# EAGLE design CANTensegrityBoard (EAGLE 6.5.0)

## Sheet 1 of 6
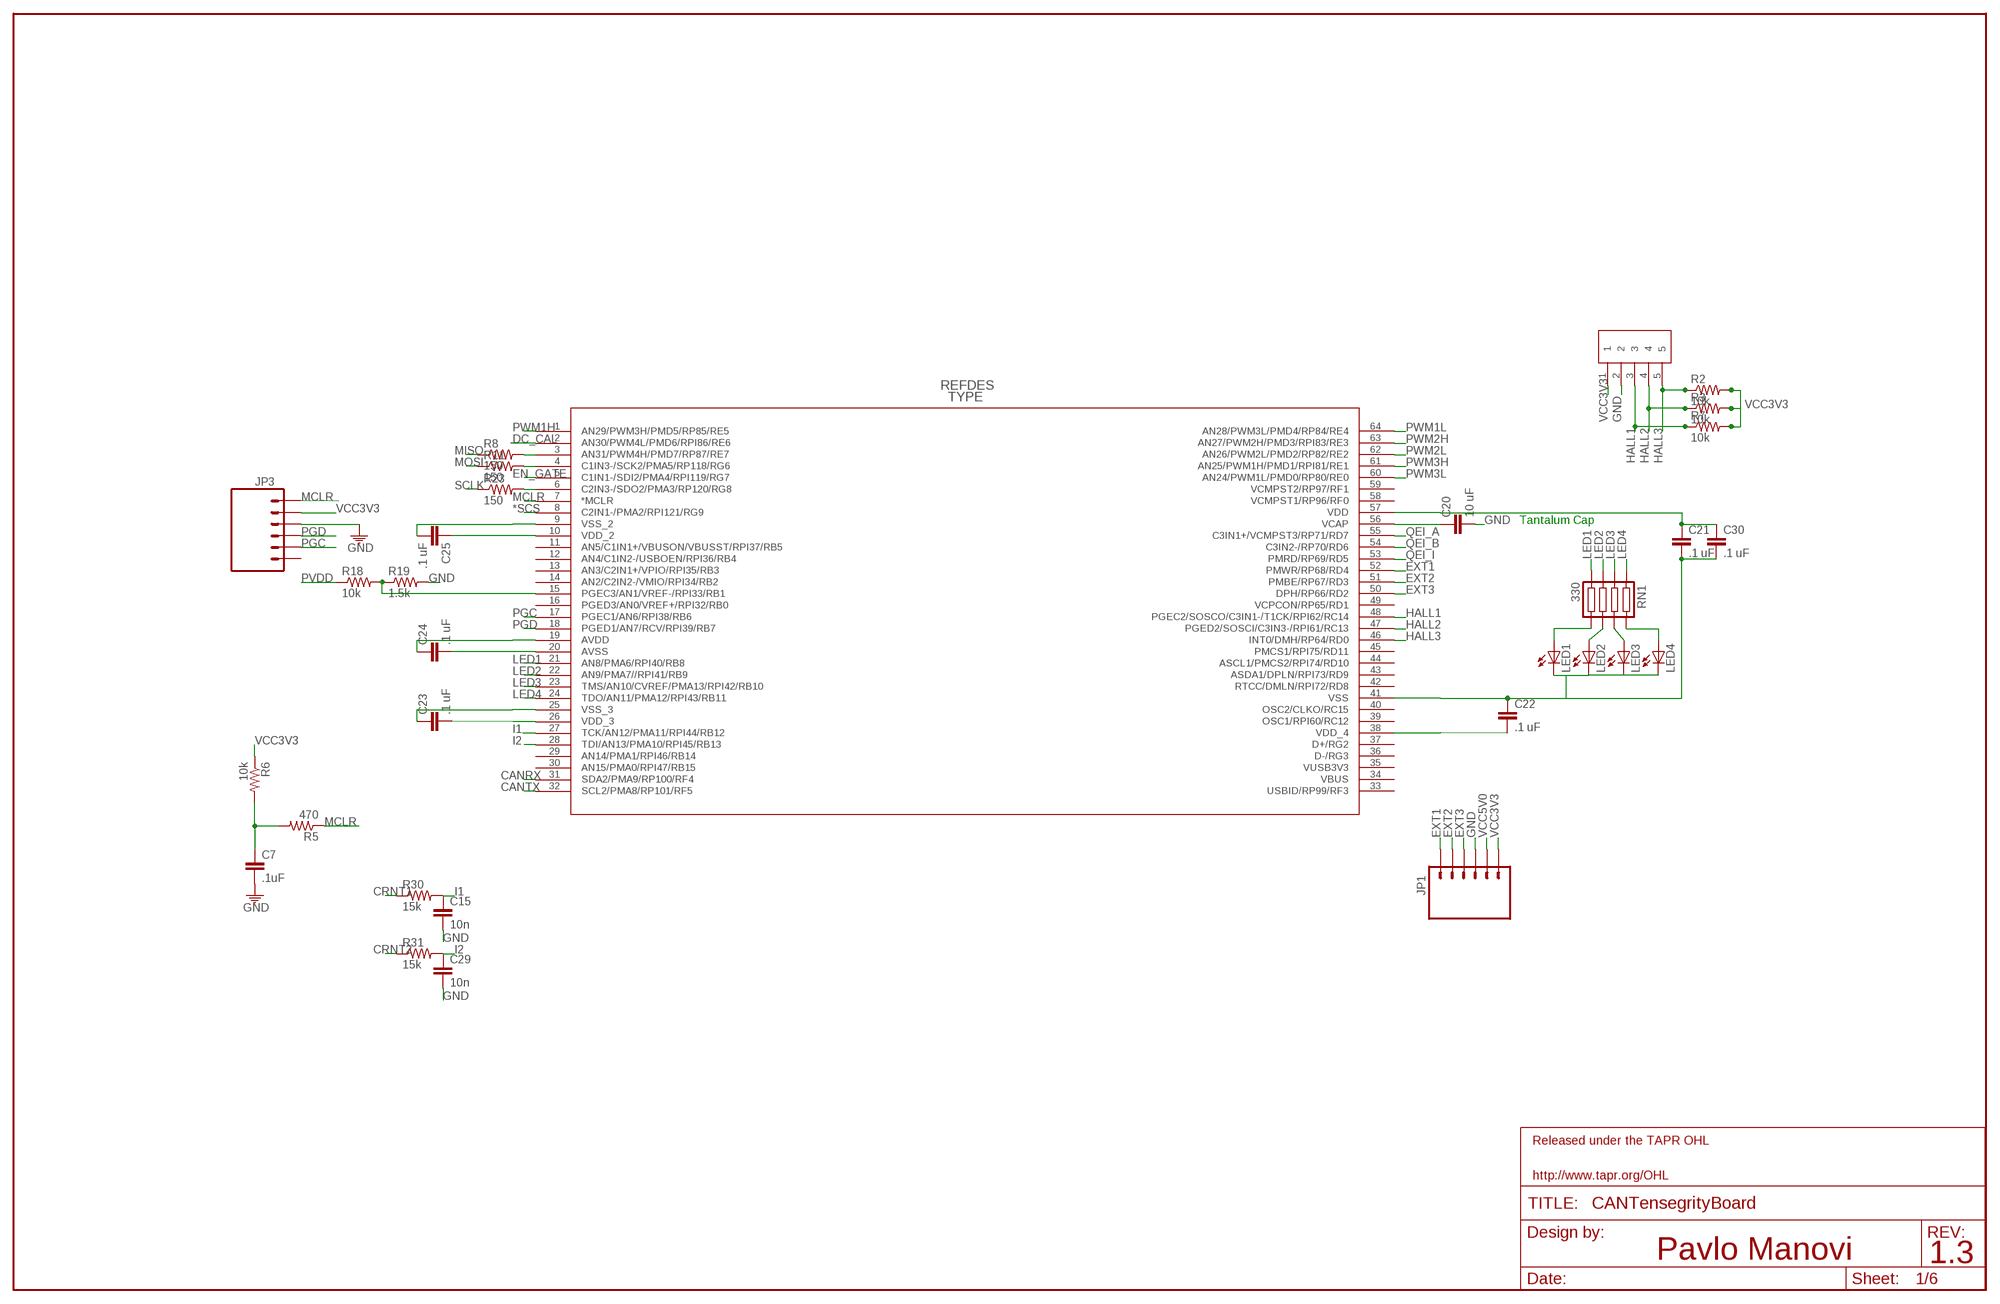
[diagram p0: schematic, sheet 1]

### Parts
C7  .1uF  CAP0805  [0805]
C15  10n  CAP0805  [0805]
C20  10 uF  CAP0805  [0805]
C21  .1 uF  CAP0805  [0805]
C22  .1 uF  CAP0805  [0805]
C23  .1 uF  CAP0805  [0805]
C24  .1 uF  CAP0805  [0805]
C25  .1 uF  CAP0805  [0805]
C29  10n  CAP0805  [0805]
C30  .1 uF  CAP0805  [0805]
JP1  M06DUAL_ROW  [2X03]
JP3  M06LOCK  [1X06_LOCK]
LED1  LED0805  [LED-0805]
LED2  LED0805  [LED-0805]
LED3  LED0805  [LED-0805]
LED4  LED0805  [LED-0805]
R2  10k  RESISTOR0805-RES  [0805]
R3  10k  RESISTOR0805-RES  [0805]
R5  470  RESISTOR0805-RES  [0805]
R6  10k  RESISTOR0805-RES  [0805]
R7  10k  RESISTOR0805-RES  [0805]
R8  150  RESISTOR0805-RES  [0805]
R11  150  RESISTOR0805-RES  [0805]
R18  10k  RESISTOR0805-RES  [0805]
R19  1.5k  RESISTOR0805-RES  [0805]
R23  150  RESISTOR0805-RES  [0805]
R30  15k  RESISTOR0805-RES  [0805]
R31  15k  RESISTOR0805-RES  [0805]
RN1  330  RESISTOR_ARRAY-4  [EXB-38V271JV]
U6  DSPIC33EP256MU80  [QFP64-10X10MC]
U$20  MICROCLASP5  [55932-0510]

### Nets
*SCS [Power]: U6.8(C2IN1-/PMA2/RPI121/RG9) ; also sheet 2
CANRX: U6.31(SDA2/PMA9/RP100/RF4) ; also sheet 4
CANTX: U6.32(SCL2/PMA8/RP101/RF5) ; also sheet 4
CRNT1: R30.1 ; also sheet 2
CRNT2: R31.1 ; also sheet 2
DC_CAL: U6.2(AN30/PWM4L/PMD6/RPI86/RE6) ; also sheet 2
EN_GATE: U6.5(C1IN1-/SDI2/PMA4/RPI119/RG7) ; also sheet 2
EXT1: JP1.1 U6.52(PMWR/RP68/RD4)
EXT2: JP1.2 U6.51(PMBE/RP67/RD3)
EXT3: JP1.3 U6.50(DPH/RP66/RD2)
GND [Power]: C7.2 C15.2 C20.2 C21.2 C22.1 C23.1 C24.2 C25.2 C29.2 C30.2 JP1.4 JP3.3 LED1.2(C) LED2.2(C) LED3.2(C) LED4.2(C) R19.2 U6.9(VSS_2) U6.20(AVSS) U6.25(VSS_3) U6.41(VSS) U$20.2 ; also sheet 2,3,4,5,6
HALL1: R7.1 U6.48(PGEC2/SOSCO/C3IN1-/T1CK/RPI62/RC14) U$20.3
HALL2: R3.1 U6.47(PGED2/SOSCI/C3IN3-/RPI61/RC13) U$20.4
HALL3: R2.1 U6.46(INT0/DMH/RP64/RD0) U$20.5
I1: C15.1 R30.2 U6.27(TCK/AN12/PMA11/RPI44/RB12)
I2: C29.1 R31.2 U6.28(TDI/AN13/PMA10/RPI45/RB13)
LED1: RN1.P$4 U6.21(AN8/PMA6/RPI40/RB8)
LED2: RN1.P$3 U6.22(AN9/PMA7//RPI41/RB9)
LED3: RN1.P$2 U6.23(TMS/AN10/CVREF/PMA13/RPI42/RB10)
LED4: RN1.P$1 U6.24(TDO/AN11/PMA12/RPI43/RB11)
MCLR: JP3.1 R5.1 U6.7(*MCLR)
MISO: R8.1 ; also sheet 2
MOSI: R11.1 ; also sheet 2
N$2: C7.1 R5.2 R6.2
N$3: R8.2 U6.3(AN31/PWM4H/PMD7/RP87/RE7)
N$7: R11.2 U6.4(C1IN3-/SCK2/PMA5/RP118/RG6)
N$8: R23.2 U6.6(C2IN3-/SDO2/PMA3/RP120/RG8)
N$25: R18.2 R19.1 U6.15(PGEC3/AN1/VREF-/RPI33/RB1)
N$31: C20.1 U6.56(VCAP)
N$44: LED1.1(A) RN1.P$5
N$45: LED2.1(A) RN1.P$6
N$46: LED3.1(A) RN1.P$7
N$47: LED4.1(A) RN1.P$8
PGC: JP3.5 U6.17(PGEC1/AN6/RPI38/RB6)
PGD [small]: JP3.4 U6.18(PGED1/AN7/RCV/RPI39/RB7)
PVDD [Power]: R18.1 ; also sheet 2,3,5
PWM1H: U6.1(AN29/PWM3H/PMD5/RP85/RE5) ; also sheet 2
PWM1L: U6.64(AN28/PWM3L/PMD4/RP84/RE4) ; also sheet 2
PWM2H: U6.63(AN27/PWM2H/PMD3/RPI83/RE3) ; also sheet 2
PWM2L: U6.62(AN26/PWM2L/PMD2/RP82/RE2) ; also sheet 2
PWM3H: U6.61(AN25/PWM1H/PMD1/RPI81/RE1) ; also sheet 2
PWM3L: U6.60(AN24/PWM1L/PMD0/RP80/RE0) ; also sheet 2
QEI_A: U6.55(C3IN1+/VCMPST3/RP71/RD7) ; also sheet 6
QEI_B: U6.54(C3IN2-/RP70/RD6) ; also sheet 6
QEI_I: U6.53(PMRD/RP69/RD5) ; also sheet 6
SCLK: R23.1 ; also sheet 2
VCC3V3 [Power]: C21.1 C22.2 C23.2 C24.1 C25.1 C30.1 JP1.6 JP3.2 R2.2 R3.2 R6.1 R7.2 U6.10(VDD_2) U6.19(AVDD) U6.26(VDD_3) U6.38(VDD_4) U6.57(VDD) U$20.1 ; also sheet 2,4,5,6
VCC5V0: JP1.5 ; also sheet 5,6
Unconnected: JP3.6 U6.11(AN5/C1IN1+/VBUSON/VBUSST/RPI37/RB5) U6.12(AN4/C1IN2-/USBOEN/RPI36/RB4) U6.13(AN3/C2IN1+/VPIO/RPI35/RB3) U6.14(AN2/C2IN2-/VMIO/RPI34/RB2) U6.16(PGED3/AN0/VREF+/RPI32/RB0) U6.29(AN14/PMA1/RPI46/RB14) U6.30(AN15/PMA0/RPI47/RB15) U6.33(USBID/RP99/RF3) U6.34(VBUS) U6.35(VUSB3V3) U6.36(D-/RG3) U6.37(D+/RG2) U6.39(OSC1/RPI60/RC12) U6.40(OSC2/CLKO/RC15) U6.42(RTCC/DMLN/RPI72/RD8) U6.43(ASDA1/DPLN/RPI73/RD9) U6.44(ASCL1/PMCS2/RPI74/RD10) U6.45(PMCS1/RPI75/RD11) U6.49(VCPCON/RP65/RD1) U6.58(VCMPST1/RP96/RF0) U6.59(VCMPST2/RP97/RF1)

### Notes on the sheet
- Tantalum Cap

## Sheet 2 of 6
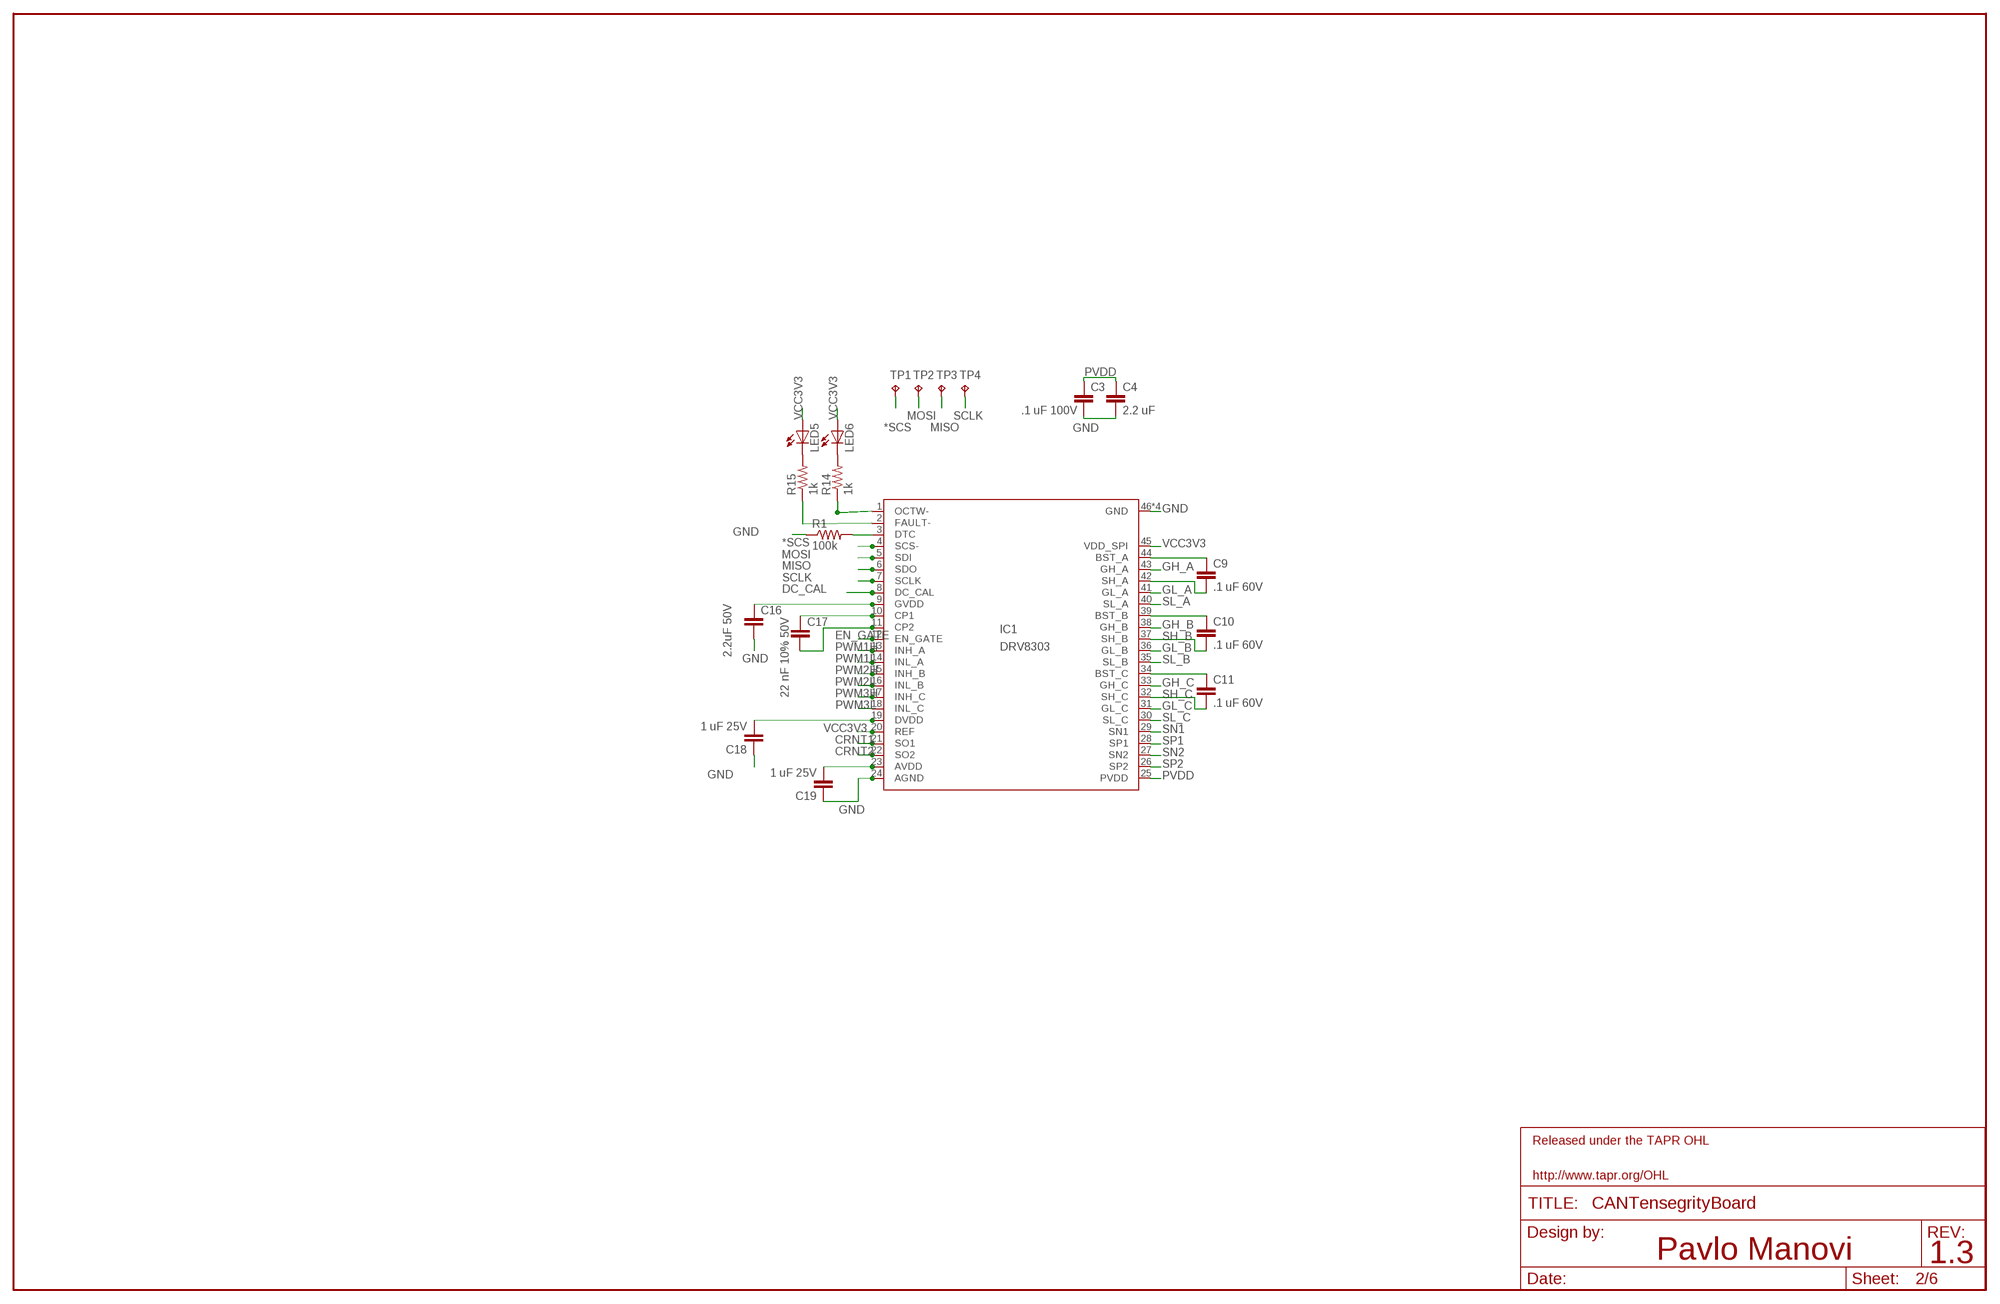
[diagram p1: schematic, sheet 2]

### Parts
C3  .1 uF 100V  CAP0805  [0805]
C4  2.2 uF  CAP0805  [0805]
C9  .1 uF 60V  CAP0805  [0805]
C10  .1 uF 60V  CAP0805  [0805]
C11  .1 uF 60V  CAP0805  [0805]
C16  2.2uF 50V  CAP0805  [0805]
C17  22 nF 10% 50V  CAP0805  [0805]
C18  1 uF 25V  CAP0805  [0805]
C19  1 uF 25V  CAP0805  [0805]
IC1  DRV8303  [HTSSOP-480-DCA]
LED5  LED0805  [LED-0805]
LED6  LED0805  [LED-0805]
R1  100k  RESISTOR0805-RES  [0805]
R14  1k  RESISTOR0805-RES  [0805]
R15  1k  RESISTOR0805-RES  [0805]
TP1  TPTP06R  [TP06R]
TP2  TPTP06R  [TP06R]
TP3  TPTP06R  [TP06R]
TP4  TPTP06R  [TP06R]

### Nets
*SCS [Power]: IC1.4(SCS-) TP1.TP ; also sheet 1
BST_B: C10.1 IC1.39(BST_B)
BST_C: C11.1 IC1.34(BST_C)
CRNT1: IC1.21(SO1) ; also sheet 1
CRNT2: IC1.22(SO2) ; also sheet 1
DC_CAL: IC1.8(DC_CAL) ; also sheet 1
EN_GATE: IC1.12(EN_GATE) ; also sheet 1
GH_A: IC1.43(GH_A) ; also sheet 3
GH_B: IC1.38(GH_B) ; also sheet 3
GH_C: IC1.33(GH_C) ; also sheet 3
GL_A: IC1.41(GL_A) ; also sheet 3
GL_B: IC1.36(GL_B) ; also sheet 3
GL_C: IC1.31(GL_C) ; also sheet 3
GND [Power]: C3.2 C4.2 C16.2 C18.1 C19.1 IC1.24(AGND) IC1.46(GND) IC1.47(GND) IC1.48(GND) IC1.49(GND) R1.1 ; also sheet 1,3,4,5,6
MISO: IC1.6(SDO) TP3.TP ; also sheet 1
MOSI: IC1.5(SDI) TP2.TP ; also sheet 1
N$1: IC1.3(DTC) R1.2
N$4: C9.1 IC1.44(BST_A)
N$11: LED5.2(C) R15.2
N$12: IC1.1(OCTW-) R14.1
N$17: LED6.2(C) R14.2
N$18: C16.1 IC1.9(GVDD)
N$19: C17.1 IC1.10(CP1)
N$20: C17.2 IC1.11(CP2)
N$21: C18.2 IC1.19(DVDD)
N$22: C19.2 IC1.23(AVDD)
N$24: IC1.2(FAULT-) R15.1
PVDD [Power]: C3.1 C4.1 IC1.25(PVDD) ; also sheet 1,3,5
PWM1H: IC1.13(INH_A) ; also sheet 1
PWM1L: IC1.14(INL_A) ; also sheet 1
PWM2H: IC1.15(INH_B) ; also sheet 1
PWM2L: IC1.16(INL_B) ; also sheet 1
PWM3H: IC1.17(INH_C) ; also sheet 1
PWM3L: IC1.18(INL_C) ; also sheet 1
SCLK: IC1.7(SCLK) TP4.TP ; also sheet 1
SH_A: C9.2 IC1.42(SH_A) ; also sheet 3
SH_B: C10.2 IC1.37(SH_B) ; also sheet 3
SH_C: C11.2 IC1.32(SH_C) ; also sheet 3
SL_A: IC1.40(SL_A) ; also sheet 3
SL_B [Power]: IC1.35(SL_B) ; also sheet 3
SL_C: IC1.30(SL_C) ; also sheet 3
SN1: IC1.29(SN1) ; also sheet 3
SN2: IC1.27(SN2) ; also sheet 3
SP1 [Power]: IC1.28(SP1) ; also sheet 3
SP2 [Power]: IC1.26(SP2) ; also sheet 3
VCC3V3 [Power]: IC1.20(REF) IC1.45(VDD_SPI) LED5.1(A) LED6.1(A) ; also sheet 1,4,5,6

## Sheet 3 of 6
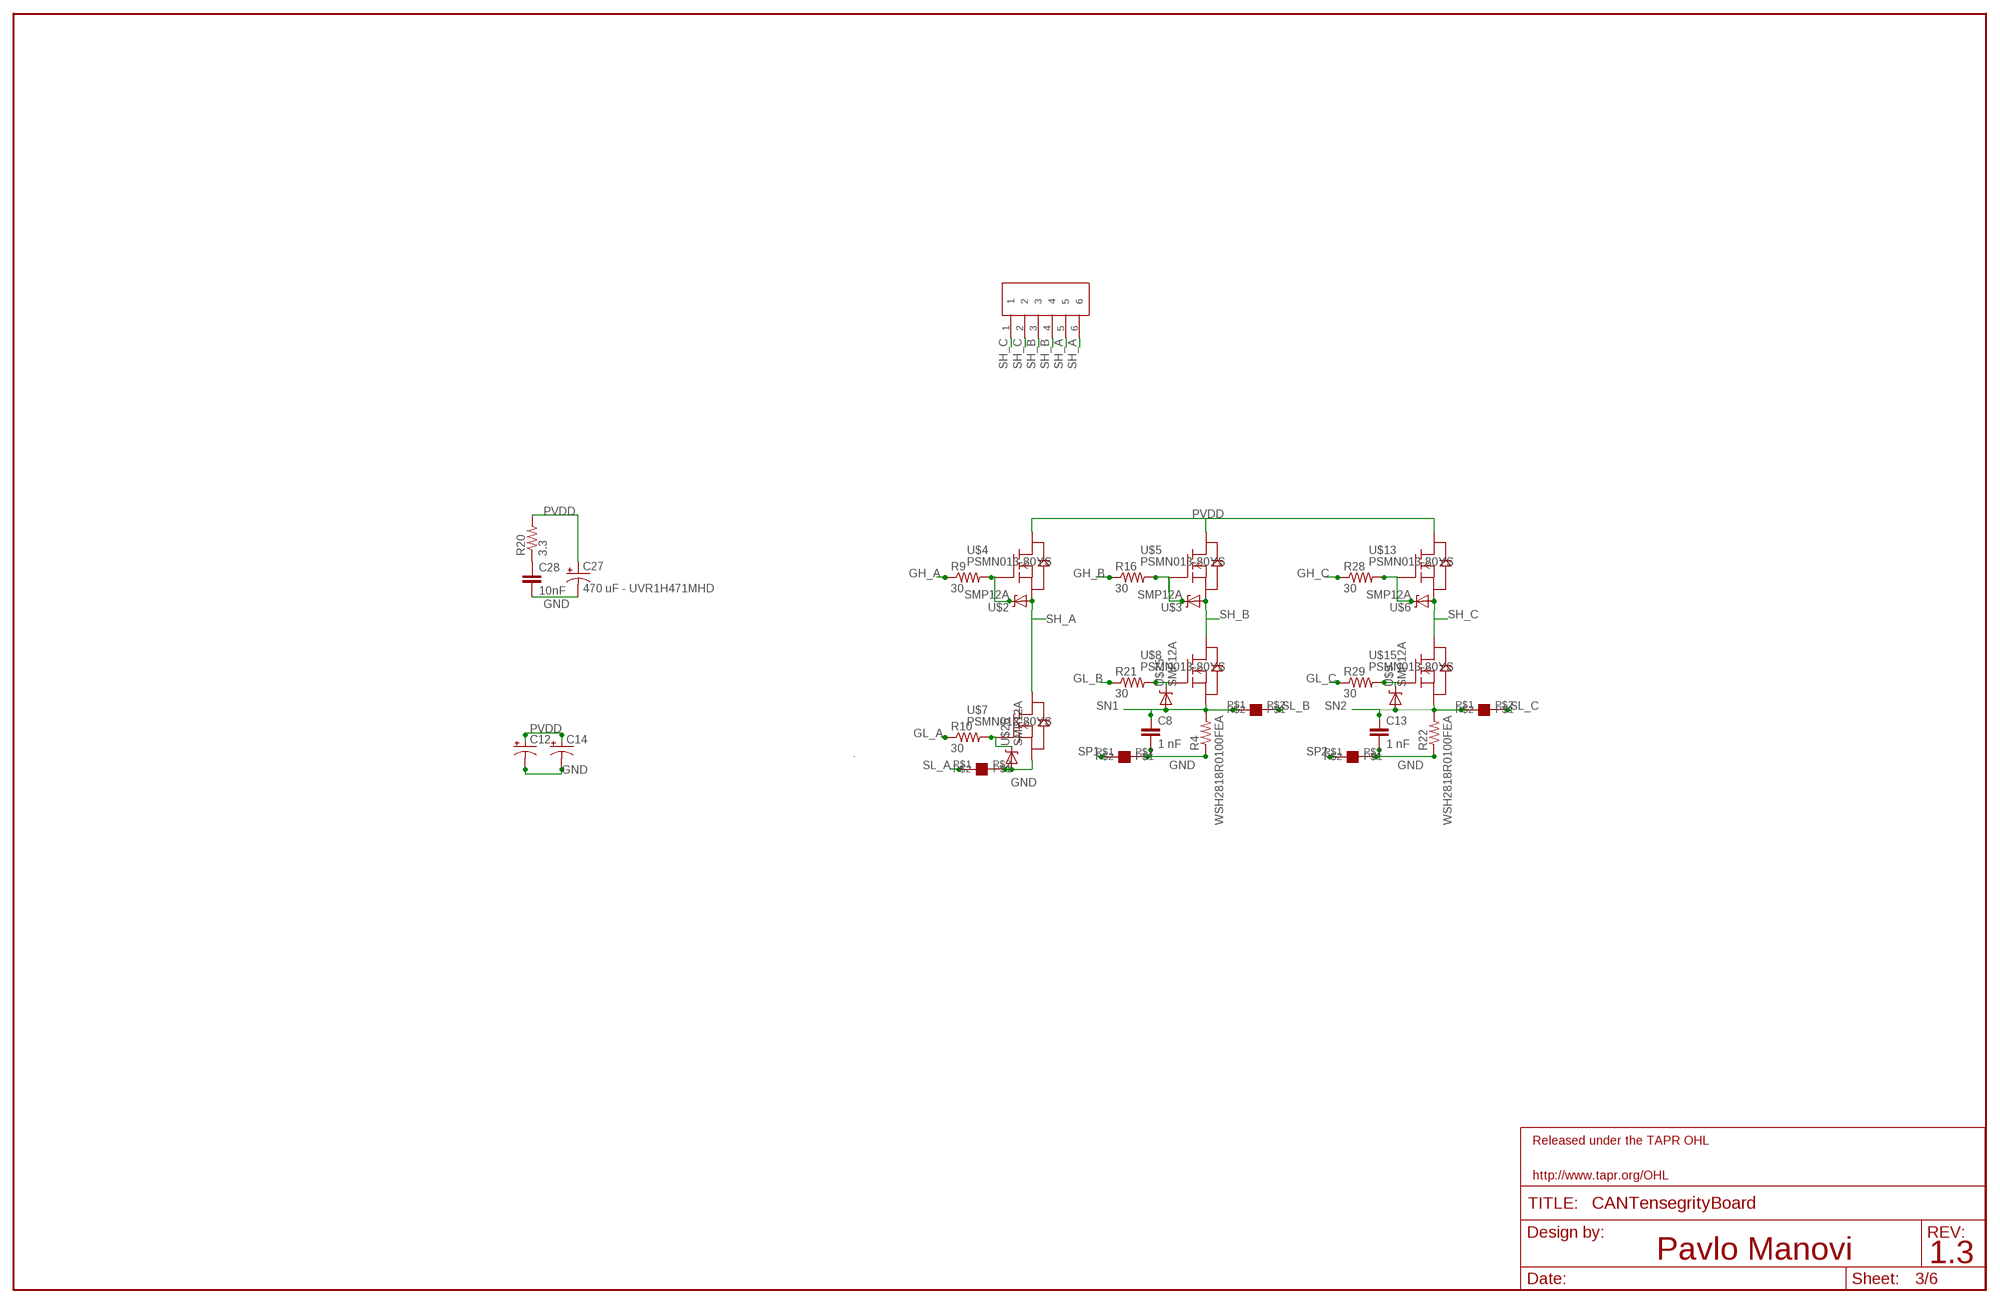
[diagram p2: schematic, sheet 3]

### Parts
C8  1 nF  CAP0805  [0805]
C12  CAP_POLPTH2  [CPOL-RADIAL-10UF-25V]
C13  1 nF  CAP0805  [0805]
C14  CAP_POLPTH2  [CPOL-RADIAL-10UF-25V]
C27  470 uF - UVR1H471MHD  CAP_POLPTH4  [CPOL-RADIAL-1000UF-25V]
C28  10nF  CAP0805  [0805]
R4  WSH2818R0100FEA  RESISTOR  [SMT-REF]
R9  30  RESISTOR0805-RES  [0805]
R10  30  RESISTOR0805-RES  [0805]
R16  30  RESISTOR0805-RES  [0805]
R20  3.3  RESISTOR0805-RES  [0805]
R21  30  RESISTOR0805-RES  [0805]
R22  WSH2818R0100FEA  RESISTOR  [SMT-REF]
R28  30  RESISTOR0805-RES  [0805]
R29  30  RESISTOR0805-RES  [0805]
U$2  SMP12A  [DO-220AA]
U$3  SMP12A  [DO-220AA]
U$4  PSMN013-80YS  [TO127P600X120-5N]
U$5  PSMN013-80YS  [TO127P600X120-5N]
U$6  SMP12A  [DO-220AA]
U$7  PSMN013-80YS  [TO127P600X120-5N]
U$8  PSMN013-80YS  [TO127P600X120-5N]
U$9  SMP12A  [DO-220AA]
U$10  NETJUMPER  [NETJUMPER]
U$11  NETJUMPER  [NETJUMPER]
U$12  NETJUMPER  [NETJUMPER]
U$13  PSMN013-80YS  [TO127P600X120-5N]
U$15  PSMN013-80YS  [TO127P600X120-5N]
U$17  MINIFITJR6PIN  [0039288060]
U$23  NETJUMPER  [NETJUMPER]
U$24  NETJUMPER  [NETJUMPER]
U$25  SMP12A  [DO-220AA]
U$26  SMP12A  [DO-220AA]

### Nets
GH_A: R9.1 ; also sheet 2
GH_B: R16.1 ; also sheet 2
GH_C: R28.1 ; also sheet 2
GL_A: R10.1 ; also sheet 2
GL_B: R21.1 ; also sheet 2
GL_C: R29.1 ; also sheet 2
GND [Power]: C8.2 C12.2(-) C13.2 C14.2(-) C27.2(-) C28.2 R4.1 R22.1 U$7.1(S) U$7.2(S) U$7.3(S) U$10.P$2 U$11.P$2 U$23.P$2 U$26.ANODE(A) ; also sheet 1,2,4,5,6
N$6: C28.1 R20.1
N$9: R9.2 U$2.CATHODE(C) U$4.4(G)
N$10: R10.2 U$7.4(G) U$26.CATHODE(C)
N$32: R16.2 U$3.CATHODE(C) U$5.4(G)
N$33: R21.2 U$8.4(G) U$25.CATHODE(C)
N$36: R28.2 U$6.CATHODE(C) U$13.4(G)
N$39: R29.2 U$9.CATHODE(C) U$15.4(G)
PVDD [Power]: C12.1(+) C14.1(+) C27.1(+) R20.2 U$4.5(D) U$4.P$1(D) U$4.P$2(D) U$4.P$3(D) U$4.P$4(D) U$4.P$5(D) U$4.P$6(D) U$4.P$7(D) U$4.P$8(D) U$4.P$9(D) U$5.5(D) U$5.P$1(D) U$5.P$2(D) U$5.P$3(D) U$5.P$4(D) U$5.P$5(D) U$5.P$6(D) U$5.P$7(D) U$5.P$8(D) U$5.P$9(D) U$13.5(D) U$13.P$1(D) U$13.P$2(D) U$13.P$3(D) U$13.P$4(D) U$13.P$5(D) U$13.P$6(D) U$13.P$7(D) U$13.P$8(D) U$13.P$9(D) ; also sheet 1,2,5
SH_A: U$2.ANODE(A) U$4.1(S) U$4.2(S) U$4.3(S) U$7.5(D) U$7.P$1(D) U$7.P$2(D) U$7.P$3(D) U$7.P$4(D) U$7.P$5(D) U$7.P$6(D) U$7.P$7(D) U$7.P$8(D) U$7.P$9(D) U$17.5 U$17.6 ; also sheet 2
SH_B: U$3.ANODE(A) U$5.1(S) U$5.2(S) U$5.3(S) U$8.5(D) U$8.P$1(D) U$8.P$2(D) U$8.P$3(D) U$8.P$4(D) U$8.P$5(D) U$8.P$6(D) U$8.P$7(D) U$8.P$8(D) U$8.P$9(D) U$17.3 U$17.4 ; also sheet 2
SH_C: U$6.ANODE(A) U$13.1(S) U$13.2(S) U$13.3(S) U$15.5(D) U$15.P$1(D) U$15.P$2(D) U$15.P$3(D) U$15.P$4(D) U$15.P$5(D) U$15.P$6(D) U$15.P$7(D) U$15.P$8(D) U$15.P$9(D) U$17.1 U$17.2 ; also sheet 2
SL_A: U$10.P$1 ; also sheet 2
SL_B [Power]: U$12.P$2 ; also sheet 2
SL_C: U$24.P$2 ; also sheet 2
SN1: C8.1 R4.2 U$8.1(S) U$8.2(S) U$8.3(S) U$12.P$1 U$25.ANODE(A) ; also sheet 2
SN2: C13.1 R22.2 U$9.ANODE(A) U$15.1(S) U$15.2(S) U$15.3(S) U$24.P$1 ; also sheet 2
SP1 [Power]: U$11.P$1 ; also sheet 2
SP2 [Power]: U$23.P$1 ; also sheet 2

## Sheet 4 of 6
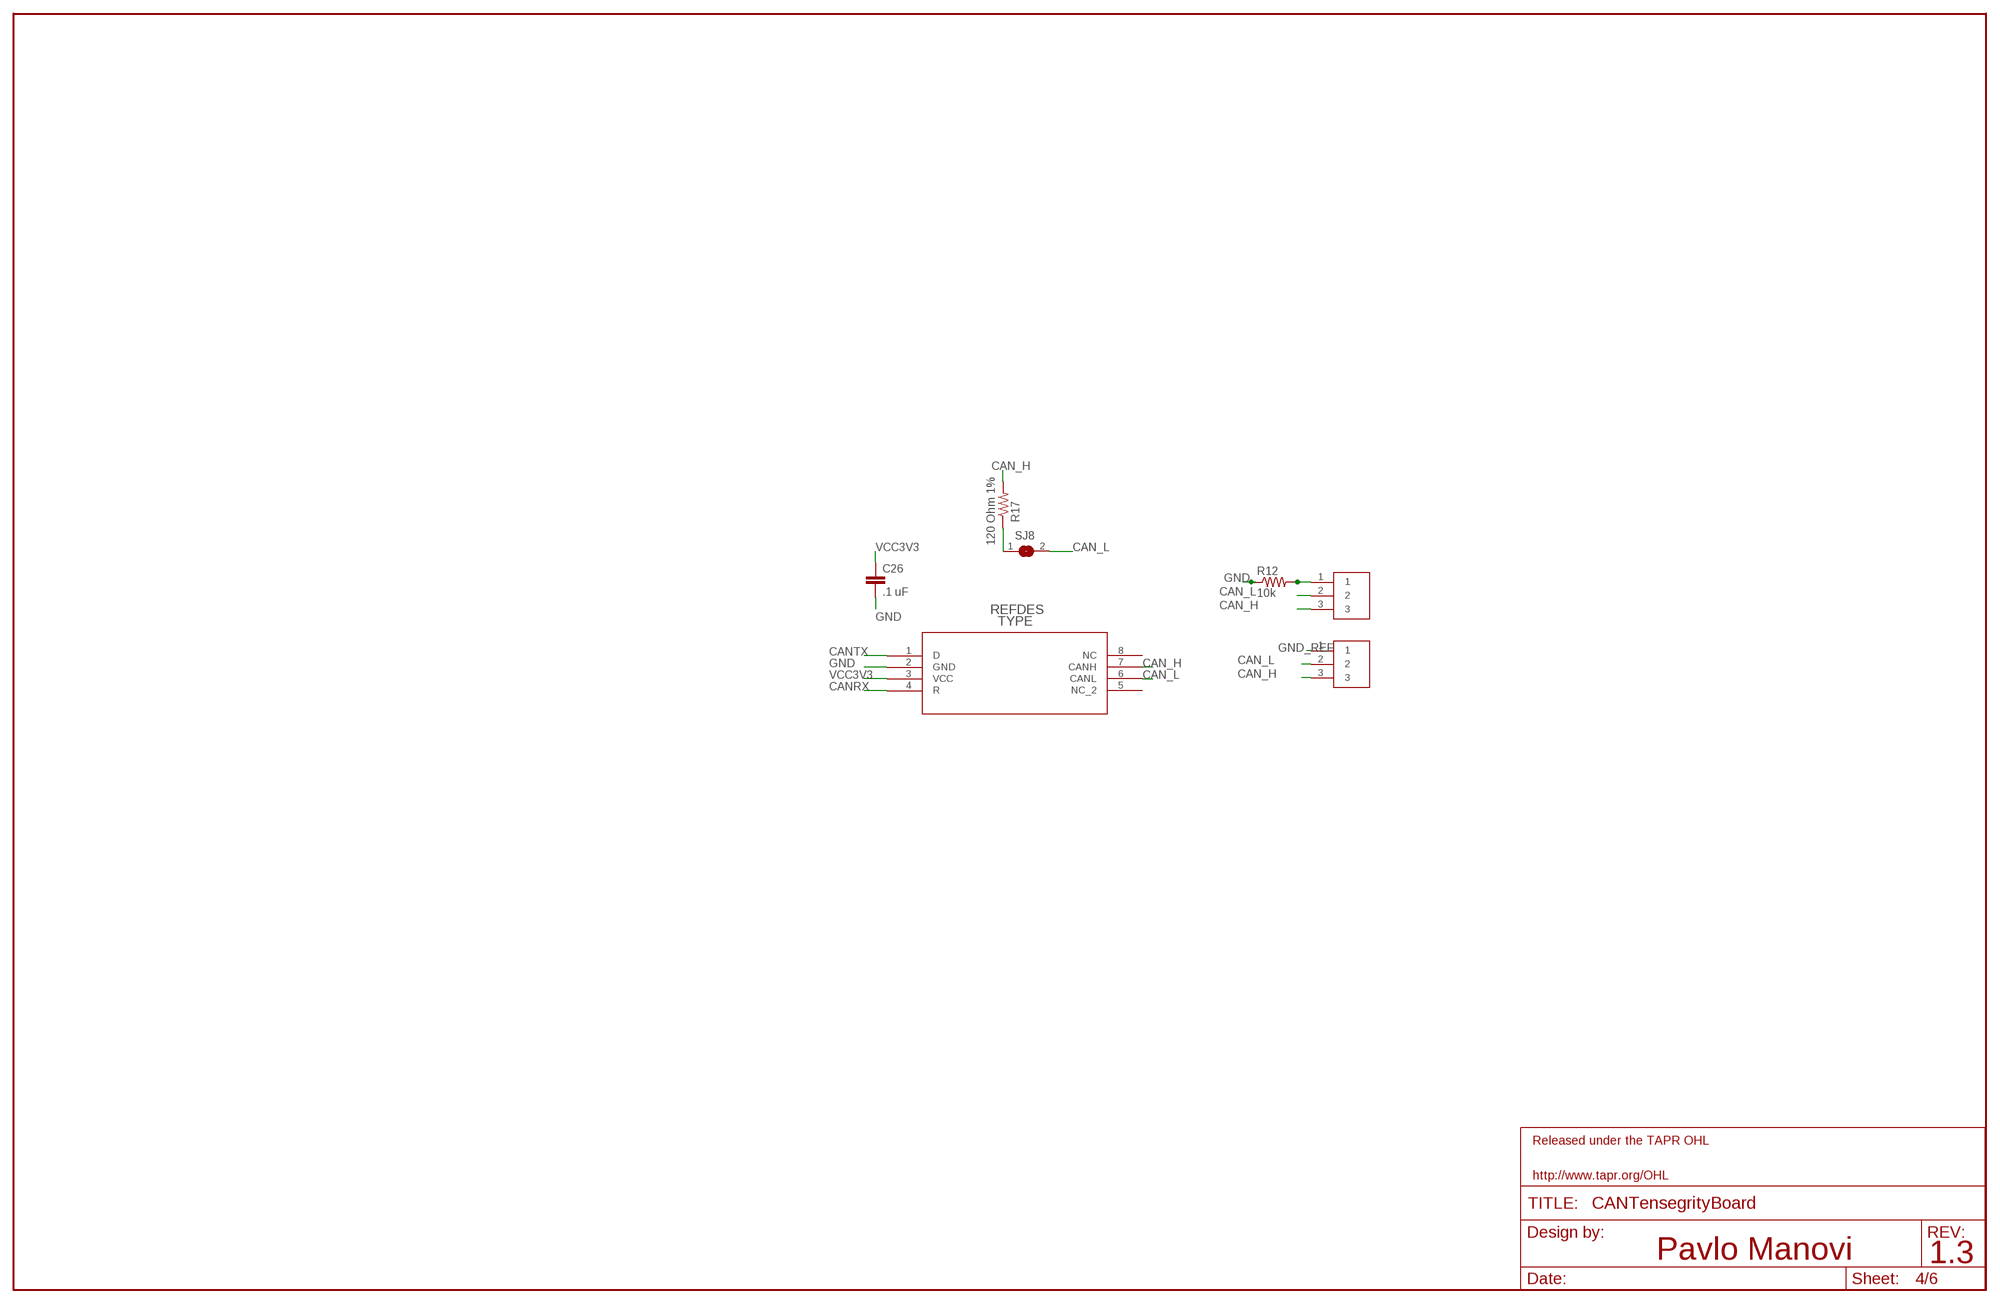
[diagram p3: schematic, sheet 4]

### Parts
C26  .1 uF  CAP0805  [0805]
R12  10k  RESISTOR0805-RES  [0805]
R17  120 Ohm 1%  RESISTOR0805-RES  [0805]
SJ8  SJ  [SJ]
U2  SN65HVD232_D_8  [D8]
U$14  MICROCLASP3  [55932-0310]
U$19  MICROCLASP3  [55932-0310]

### Nets
CAN_H: R17.2 U2.7(CANH) U$14.3 U$19.3
CAN_L: SJ8.2 U2.6(CANL) U$14.2 U$19.2
CANRX: U2.4(R) ; also sheet 1
CANTX: U2.1(D) ; also sheet 1
GND [Power]: C26.2 R12.1 U2.2(GND) ; also sheet 1,2,3,5,6
GND_REF: R12.2 U$14.1 U$19.1
N$64: R17.1 SJ8.1
VCC3V3 [Power]: C26.1 U2.3(VCC) ; also sheet 1,2,5,6
Unconnected: U2.5(NC_2) U2.8(NC)

## Sheet 5 of 6
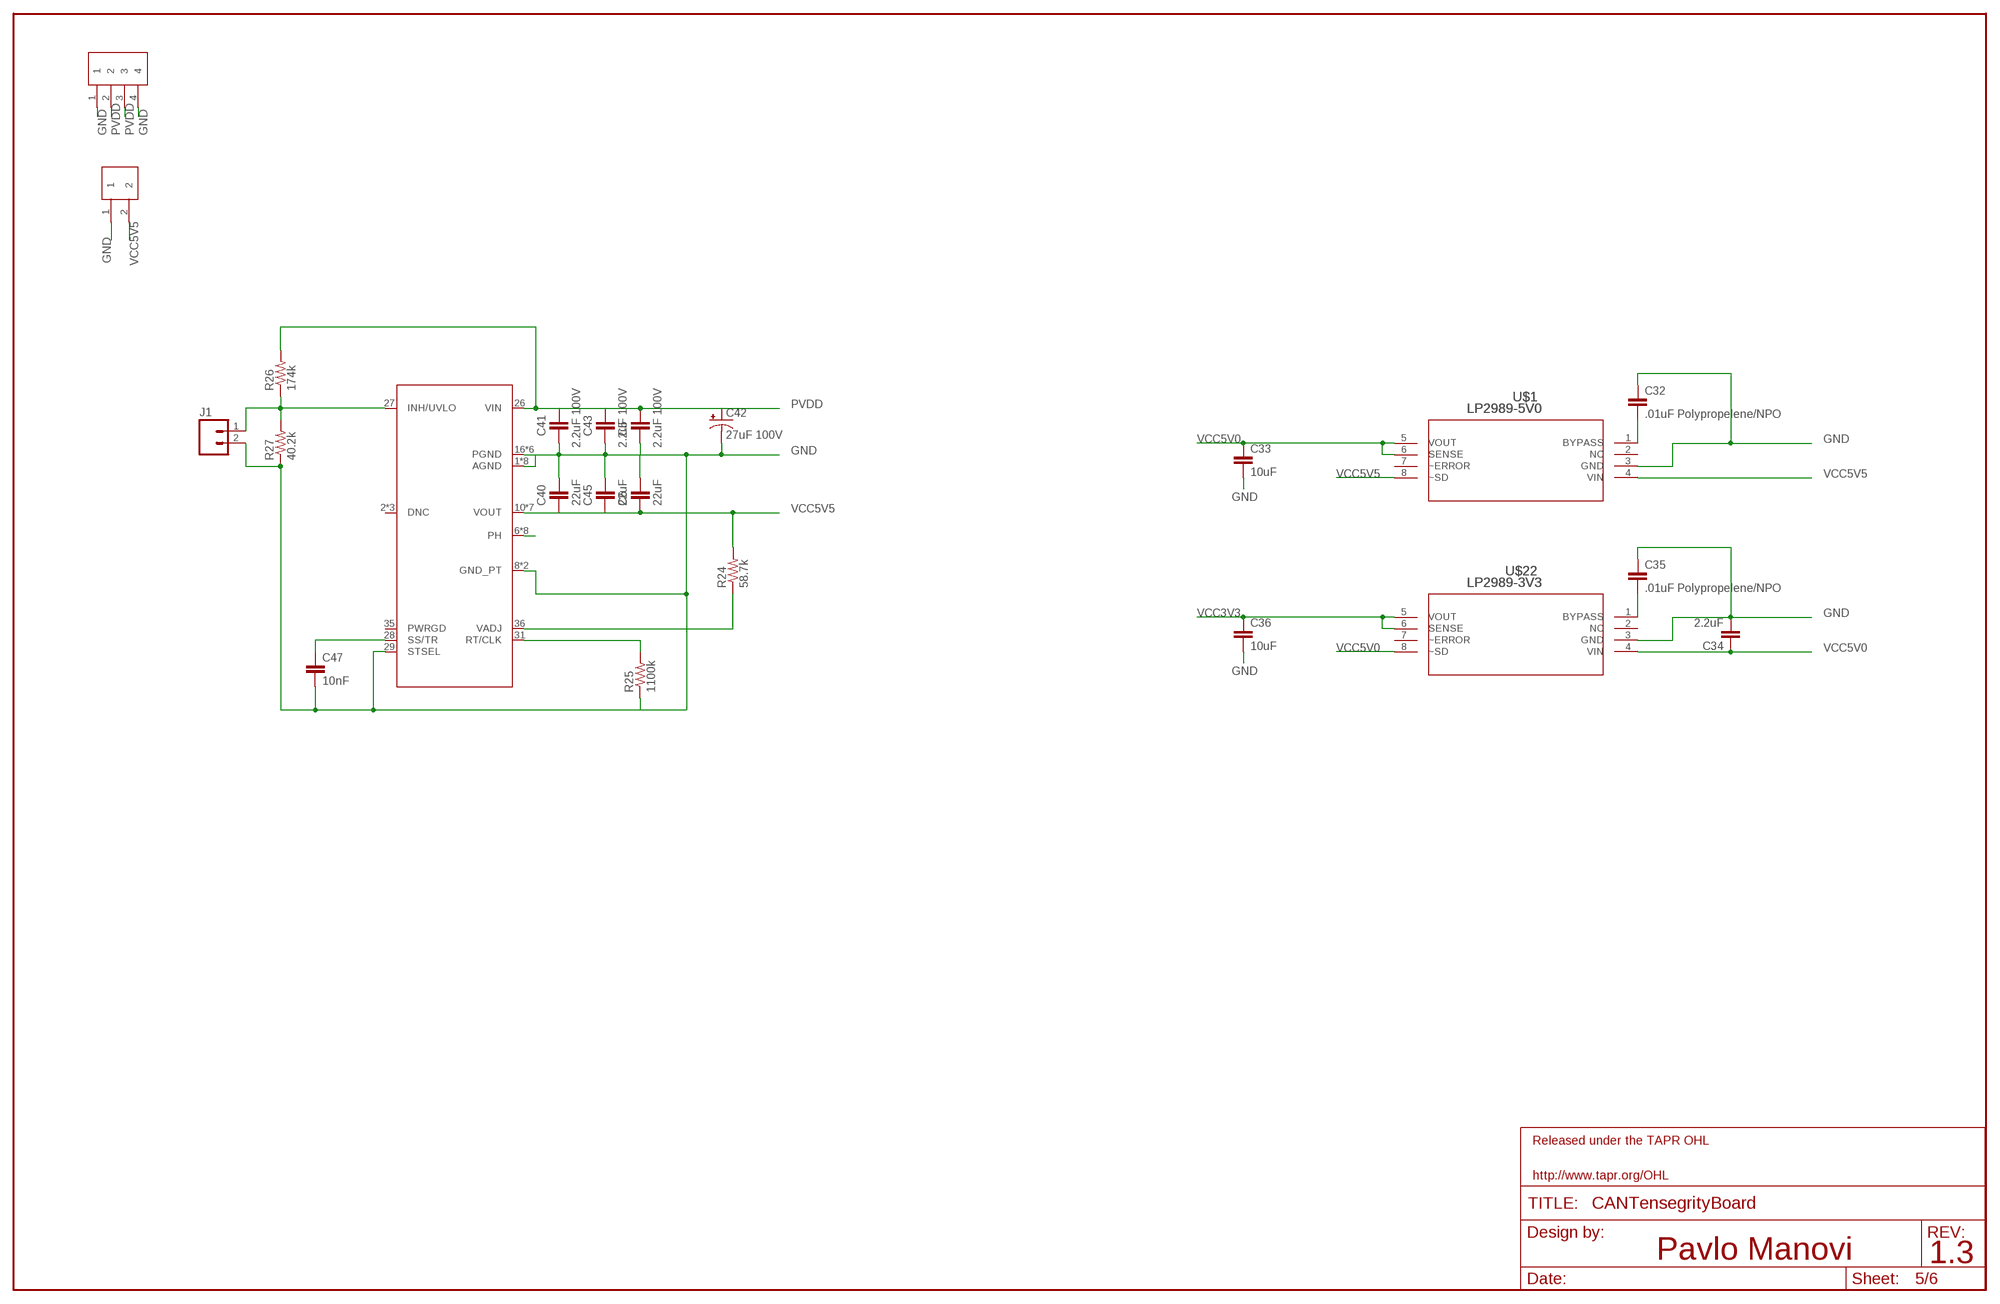
[diagram p4: schematic, sheet 5]

### Parts
C5  2.2uF 100V  CAP1210  [1210]
C6  22uF  CAP1210  [1210]
C32  .01uF Polypropelene/NPO  CAP0805  [0805]
C33  10uF  CAP0805  [0805]
C34  2.2uF  CAP0805  [0805]
C35  .01uF Polypropelene/NPO  CAP0805  [0805]
C36  10uF  CAP0805  [0805]
C40  22uF  CAP1210  [1210]
C41  2.2uF 100V  CAP1210  [1210]
C42  27uF 100V  CAP_POLPTH1  [CPOL-RADIAL-100UF-25V]
C43  2.2uF 100V  CAP1210  [1210]
C45  22uF  CAP1210  [1210]
C47  10nF  CAP0805  [0805]
J1  M02LOCK  [1X02_LOCK]
R24  58.7k  RESISTOR0805-RES  [0805]
R25  1100k  RESISTOR0805-RES  [0805]
R26  174k  RESISTOR0805-RES  [0805]
R27  40.2k  RESISTOR0805-RES  [0805]
U7  TPS84250_RKG_41  [RKG41]
U$1  LP2989-5V0  [MUA08A]
U$16  MINIFITJR4PIN  [0039288040]
U$18  MICROCLASP2  [55932-0210]
U$22  LP2989-3V3  [MUA08A]

### Nets
GND [Power]: C5.2 C6.1 C32.1 C33.2 C34.2 C35.1 C36.2 C40.1 C41.2 C42.2(-) C43.2 C45.1 C47.2 J1.2 R25.1 R27.1 U7.1(AGND) U7.4(AGND) U7.5(AGND) U7.8(GND_PT) U7.9(GND_PT) U7.16(PGND) U7.17(PGND) U7.18(PGND) U7.19(PGND) U7.20(PGND) U7.29(STSEL) U7.30(AGND) U7.32(AGND) U7.33(AGND) U7.34(AGND) U7.37(AGND) U7.40(PGND) U$1.3(GND) U$16.1 U$16.4 U$18.1 U$22.3(GND) ; also sheet 1,2,3,4,6
N$5: C35.2 U$22.1(BYPASS)
N$13: U7.6(PH) U7.7(PH) U7.21(PH) U7.22(PH) U7.23(PH) U7.24(PH) U7.38(PH) U7.41(PH)
N$14: C32.2 U$1.1(BYPASS)
N$37: R24.1 U7.36(VADJ)
N$38: R25.2 U7.31(RT/CLK)
N$41: J1.1 R26.1 R27.2 U7.27(INH/UVLO)
N$43: C47.1 U7.28(SS/TR)
PVDD [Power]: C5.1 C41.1 C42.1(+) C43.1 R26.2 U7.26(VIN) U$16.2 U$16.3 ; also sheet 1,2,3
VCC3V3 [Power]: C36.1 U$22.5(VOUT) U$22.6(SENSE) ; also sheet 1,2,4,6
VCC5V0: C33.1 C34.1 U$1.5(VOUT) U$1.6(SENSE) U$22.4(VIN) U$22.8(~SD) ; also sheet 1,6
VCC5V5: C6.2 C40.2 C45.2 R24.2 U7.10(VOUT) U7.11(VOUT) U7.12(VOUT) U7.13(VOUT) U7.14(VOUT) U7.15(VOUT) U7.39(VOUT) U$1.4(VIN) U$1.8(~SD) U$18.2
Unconnected: U7.2(DNC) U7.3(DNC) U7.25(DNC) U7.35(PWRGD) U$1.2(NC) U$1.7(~ERROR) U$22.2(NC) U$22.7(~ERROR)

## Sheet 6 of 6
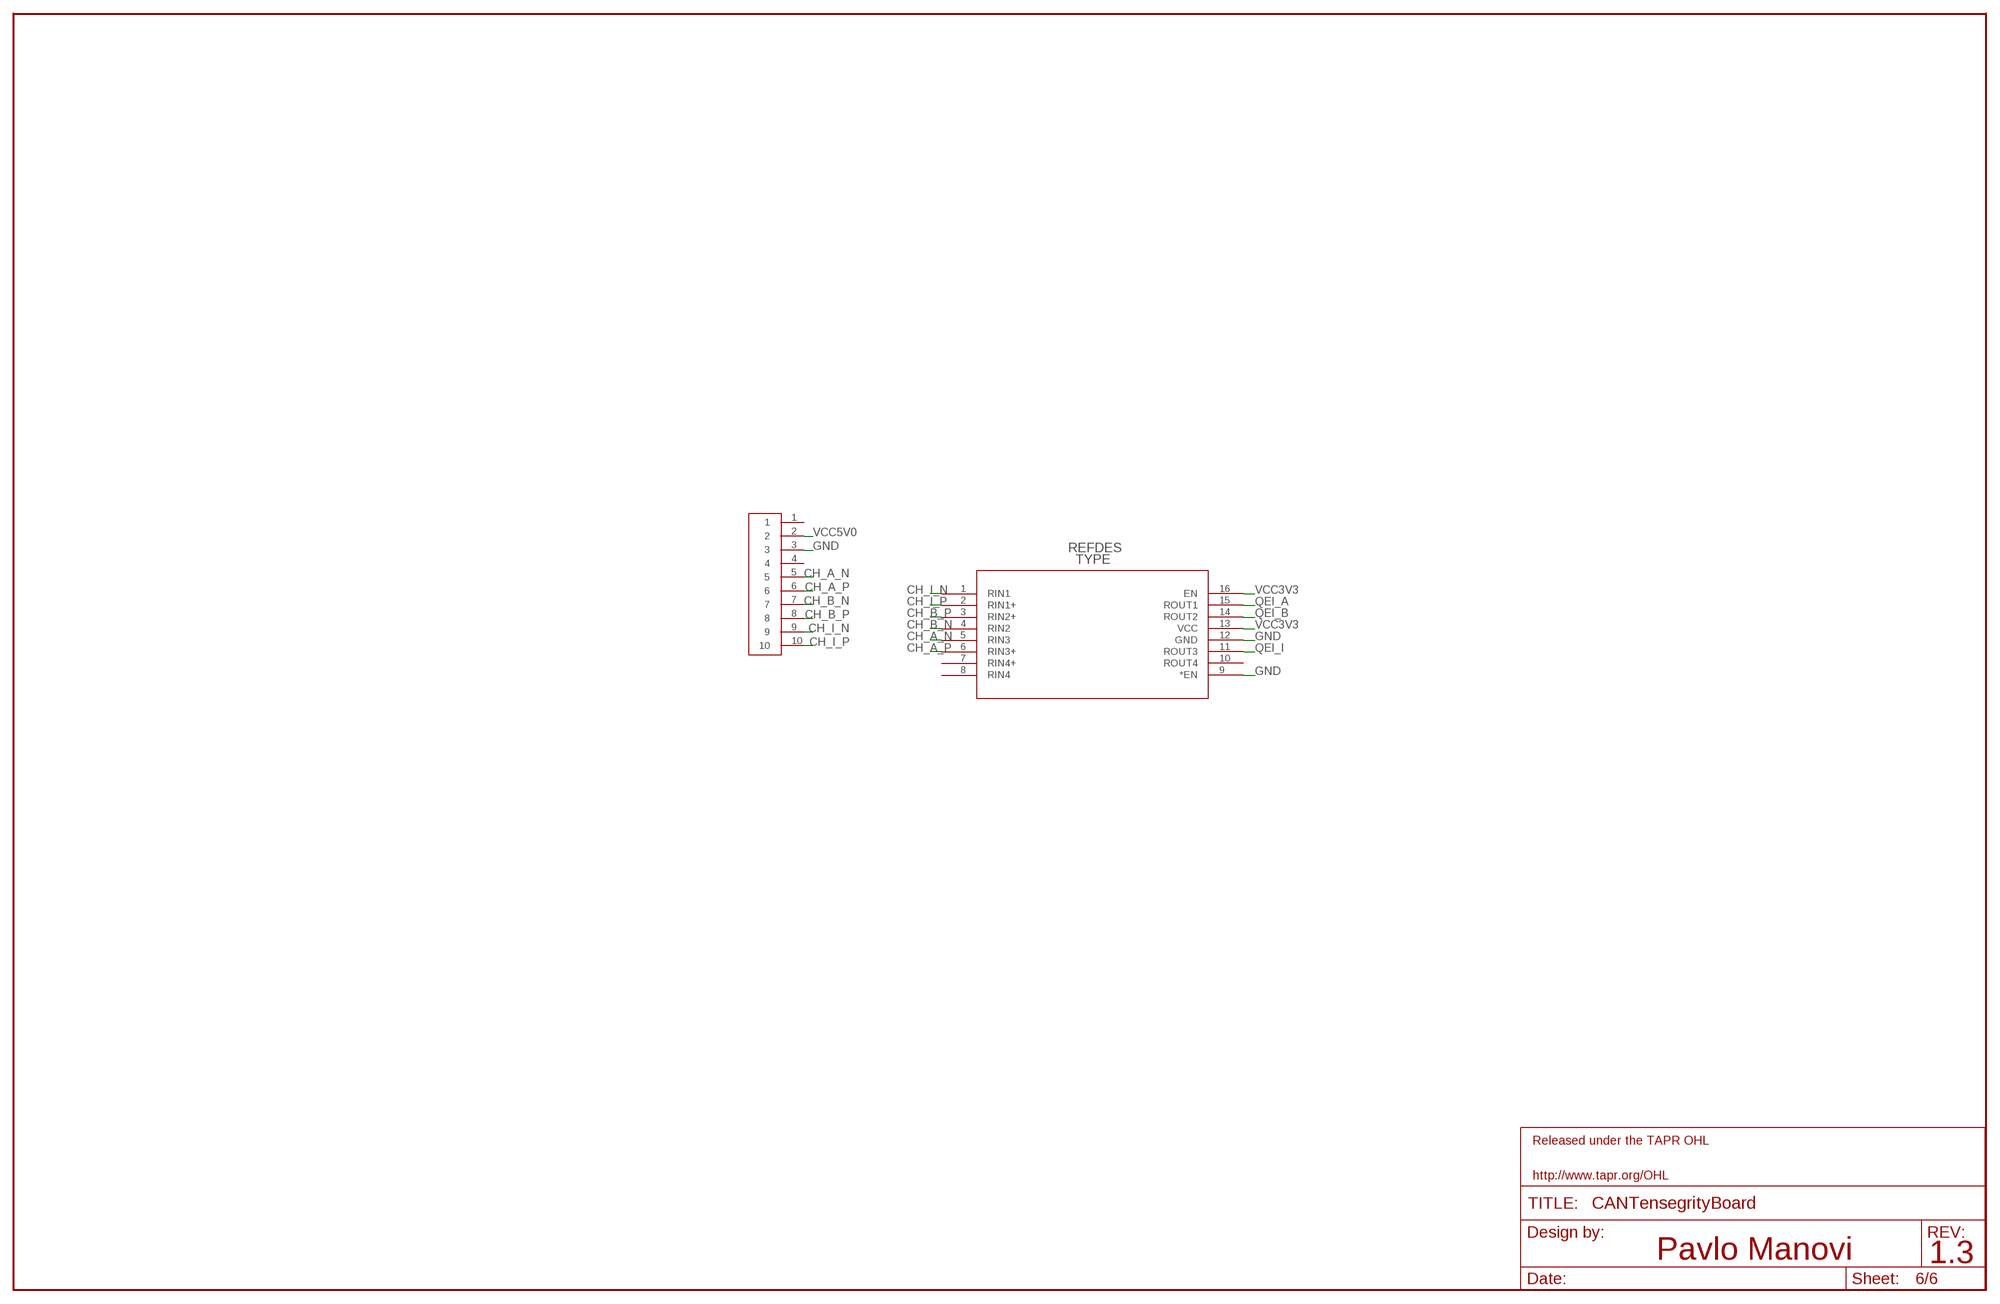
[diagram p5: schematic, sheet 6]

### Parts
U3  SN65LVDT348_PW_1  [PW16]
U$21  3M10PIN2500  [FOUR-WALL-2500-LP-STH]

### Nets
CH_A_N: U3.5(RIN3) U$21.5
CH_A_P: U3.6(RIN3+) U$21.6
CH_B_N: U3.4(RIN2) U$21.7
CH_B_P: U3.3(RIN2+) U$21.8
CH_I_N: U3.1(RIN1) U$21.9
CH_I_P: U3.2(RIN1+) U$21.10
GND [Power]: U3.9(*EN) U3.12(GND) U$21.3 ; also sheet 1,2,3,4,5
QEI_A: U3.15(ROUT1) ; also sheet 1
QEI_B: U3.14(ROUT2) ; also sheet 1
QEI_I: U3.11(ROUT3) ; also sheet 1
VCC3V3 [Power]: U3.13(VCC) U3.16(EN) ; also sheet 1,2,4,5
VCC5V0: U$21.2 ; also sheet 1,5
Unconnected: U3.7(RIN4+) U3.8(RIN4) U3.10(ROUT4) U$21.1 U$21.4

## Library data of the parts
C3 C4 C7-C11 C13 C15-C26 C28-C30 = ASL:CAP: Capacitor Standard 0603 ceramic capacitor, and 0.1" leaded capacitor.
C5 C6 C32-C36 C40 C41 C43 C45 C47 = SensorCape:CAP: Capacitor Standard 0603 ceramic capacitor, and 0.1" leaded capacitor.
C12 C14 C27 = ASL:CAP_POL: Capacitor Polarized These are standard SMD and PTH capacitors. Normally 10uF, 47uF, and 100uF in electrolytic and tantalum varieties. Always verify the external diameter of the through hole cap, it varies with capacity, voltage, and manufacturer. The EIA devices should be standard.
C42 = SensorCape:CAP_POL: Capacitor Polarized These are standard SMD and PTH capacitors. Normally 10uF, 47uF, and 100uF in electrolytic and tantalum varieties. Always verify the external diameter of the through hole cap, it varies with capacity, voltage, and manufacturer. The EIA devices should be standard.
IC1 = OpenPMSM:DRV8303: edit this description Auto generated by make-symbol-device-package-bsdl.ulp Rev. 43 Source:
J1 = ASL:M02: Header 2 Standard 2-pin 0.1" header. Use with straight break away headers (SKU : PRT-00116), right angle break away headers (PRT-00553), swiss pins (PRT-00743), machine pins (PRT-00117), and female headers (PRT-00115). Molex polarized connector foot print use with SKU : PRT-08233 with associated crimp pins and housings.
JP1 = ASL:M06: Header 6 Standard 6-pin 0.1" header. Use with straight break away headers (SKU : PRT-00116), right angle break away headers (PRT-00553), swiss pins (PRT-00743), machine pins (PRT-00117), and female headers (PRT-00115). Molex polarized connector foot print use with SKU : PRT-08094 with associated crimp pins and housings. NOTES ON THE VARIANTS LOCK and LOCK_LONGPADS... This footprint was designed to help hold the alignment of a through-hole component (i.e. 6-pin header) while soldering it into place. You may notice that each hole has been shifted either up or down by 0.005 of an inch from it's more standard position (which is a perfectly straight line). This slight alteration caused the pins (the squares in the middle) to touch the edges of the holes. Because they are alternating, it causes a "brace" to hold the component in place. 0.005 has proven to be the perfect amount of "off-center" position when using our standard breakaway headers. Although looks a little odd when you look at the bare footprint, once you have a header in there, the alteration is very hard to notice. Also, if you push a header all the way into place, it is covered up entirely on the bottom side. This idea of altering the position of holes to aid alignment will be further integrated into the Sparkfun Library for other footprints. It can help hold any component with 3 or more connection pins.
JP3 = CMPE118lib:M06: Header 6 Standard 6-pin 0.1" header. Use with straight break away headers (SKU : PRT-00116), right angle break away headers (PRT-00553), swiss pins (PRT-00743), machine pins (PRT-00117), and female headers (PRT-00115). Molex polarized connector foot print use with SKU : PRT-08094 with associated crimp pins and housings. NOTES ON THE VARIANTS LOCK and LOCK_LONGPADS... This footprint was designed to help hold the alignment of a through-hole component (i.e. 6-pin header) while soldering it into place. You may notice that each hole has been shifted either up or down by 0.005 of an inch from it's more standard position (which is a perfectly straight line). This slight alteration caused the pins (the squares in the middle) to touch the edges of the holes. Because they are alternating, it causes a "brace" to hold the component in place. 0.005 has proven to be the perfect amount of "off-center" position when using our standard breakaway headers. Although looks a little odd when you look at the bare footprint, once you have a header in there, the alteration is very hard to notice. Also, if you push a header all the way into place, it is covered up entirely on the bottom side. This idea of altering the position of holes to aid alignment will be further integrated into the Sparkfun Library for other footprints. It can help hold any component with 3 or more connection pins.
LED1-LED6 = ASL:LED: LEDs Standard schematic elements and footprints for 5mm, 3mm, 1206, and 0603 sized LEDs. 5mm - Spark Fun Electronics SKU : COM-00529 (and others)
R1-R3 R7-R12 R14-R21 R23-R31 = ASL:RESISTOR: Resistor Basic schematic elements and footprints for 0603, 1206, and PTH resistors.
R4 R22 = pavlo:RESISTOR: Resistor Basic schematic elements and footprints for 0603, 1206, and PTH resistors.
R5 R6 = CMPE118lib:RESISTOR: Resistor Basic schematic elements and footprints for 0603, 1206, and PTH resistors.
RN1 = ASL:RESISTOR_ARRAY-4: Chip Resistor Array 4 Single Resistor Source: http://industrial.panasonic.com/www-data/pdf/AOC0000/AOC0000PE2.pdf; OC_FARNELL: unknown; OC_NEWARK: unknown
SJ8 = jumper:SJ: SMD solder JUMPER
TP1-TP4 = testpad:TP: Test pad
U2 = pavlo:SN65HVD232_D_8
U3 = pavlo:SN65LVDT348_PW_1
U6 = OpenPMSM:DSPIC33EP256MU80
U7 = SensorCape:TPS84250_RKG_41
U$1 = OpenPMSM:LP2989-5V0
U$2 U$3 U$6 U$9 U$25 U$26 = OpenPMSM:SMP12A
U$4 U$5 U$7 U$8 U$13 U$15 = pavlo:PSMN013-80YS
U$10-U$12 U$23 U$24 = OpenPMSM:NETJUMPER
U$14 U$19 = OpenPMSM:MICROCLASP3
U$16 = OpenPMSM:MINIFITJR4PIN
U$17 = OpenPMSM:MINIFITJR6PIN
U$18 = OpenPMSM:MICROCLASP2
U$20 = OpenPMSM:MICROCLASP5
U$21 = OpenPMSM:3M10PIN2500
U$22 = OpenPMSM:LP2989-3V3

## Net classes
2 small: width 0.254 mm, clearance 0.254 mm to class 1
3 Power: clearance 0.381 mm to class 0

## Board
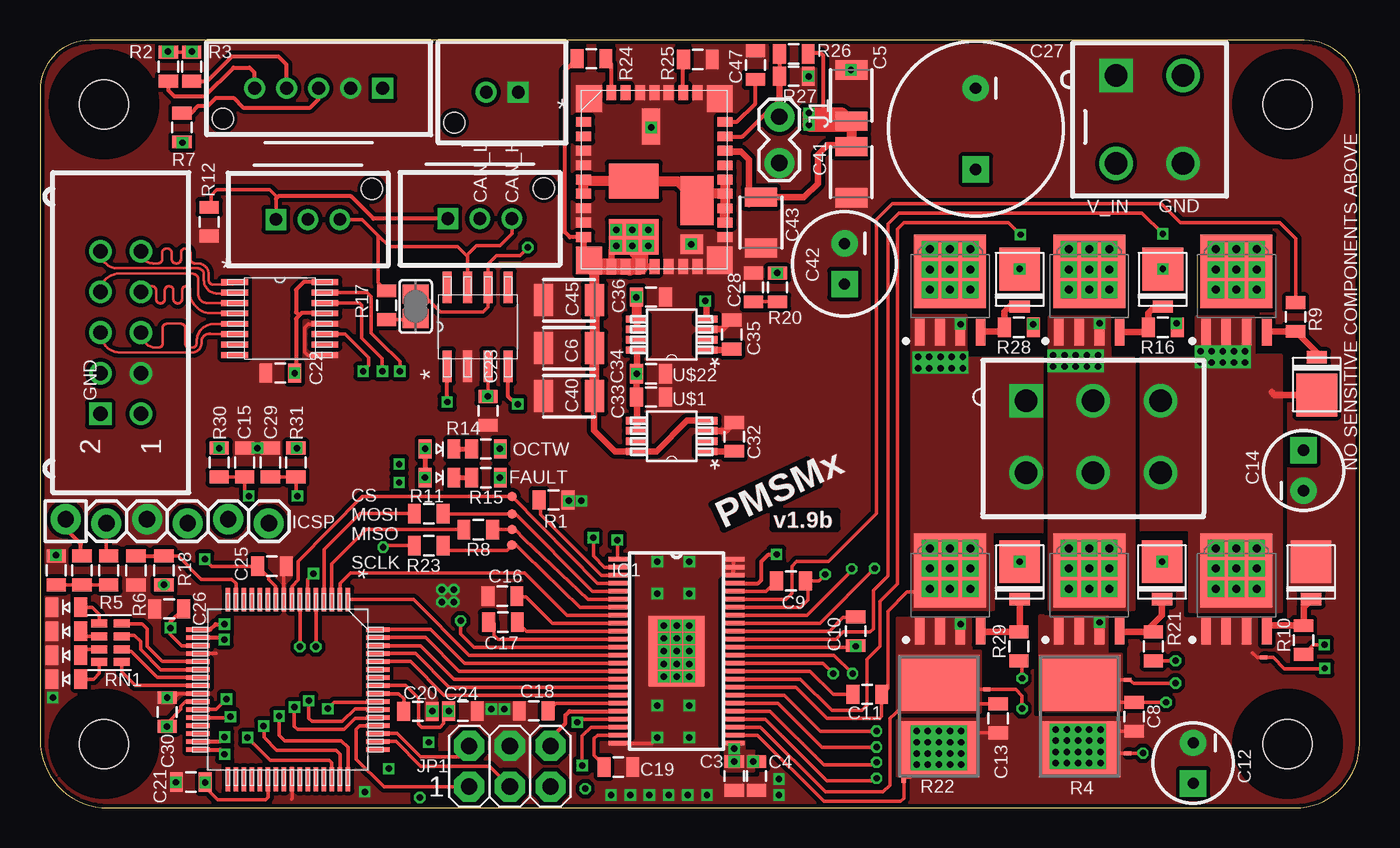
[diagram p6: board, top side]
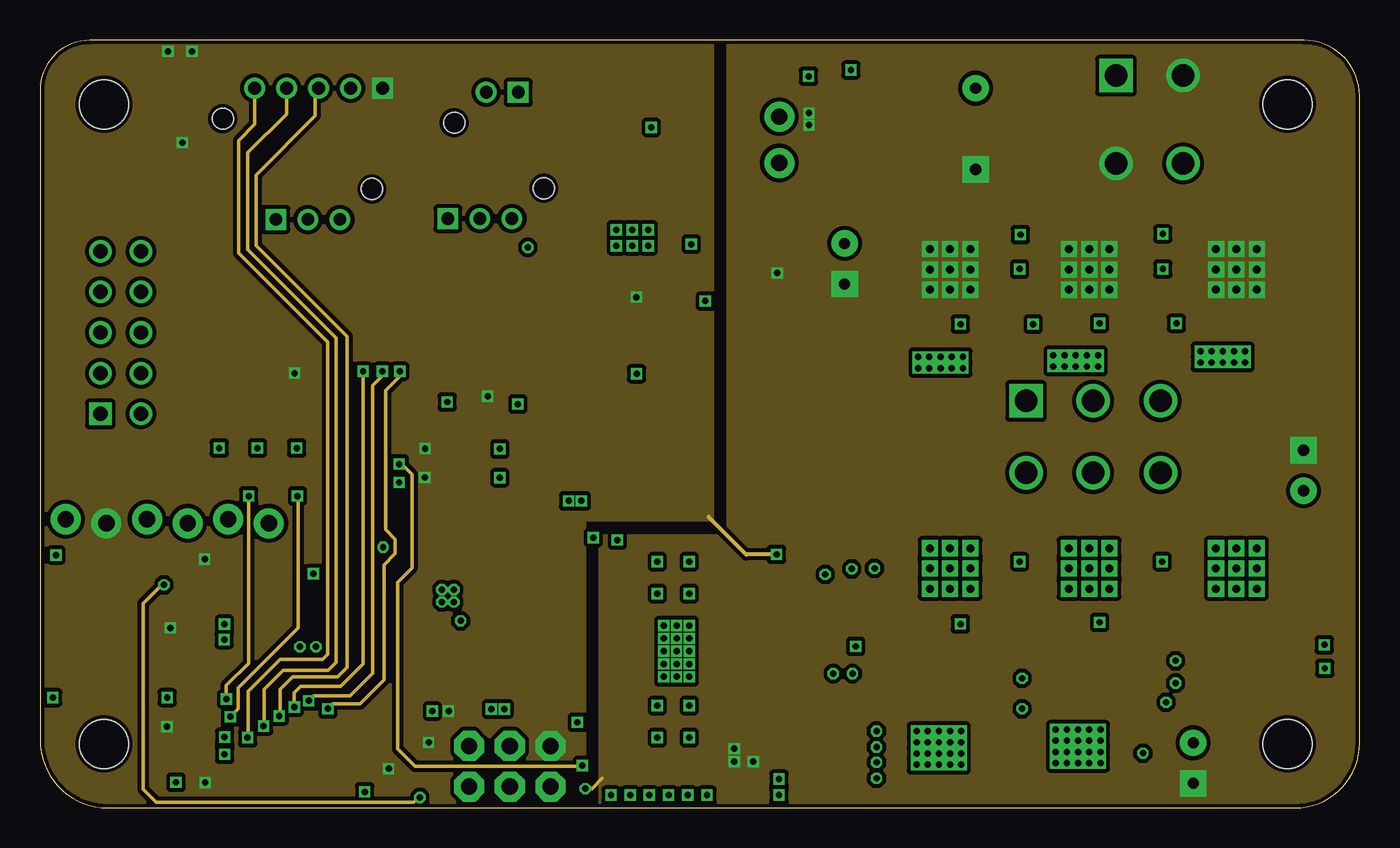
[diagram p7: board, inner layer Route2]
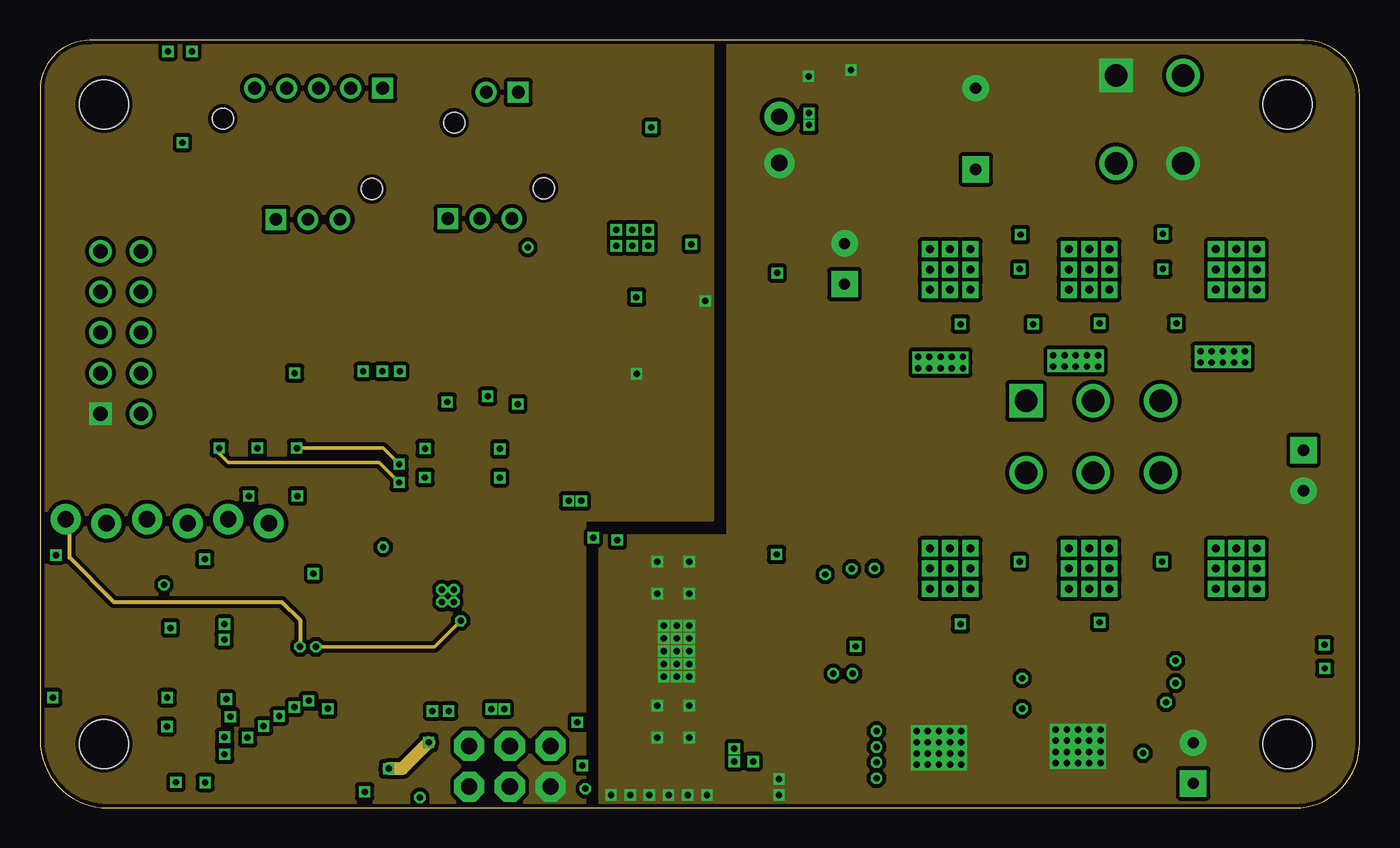
[diagram p8: board, inner layer Route15]
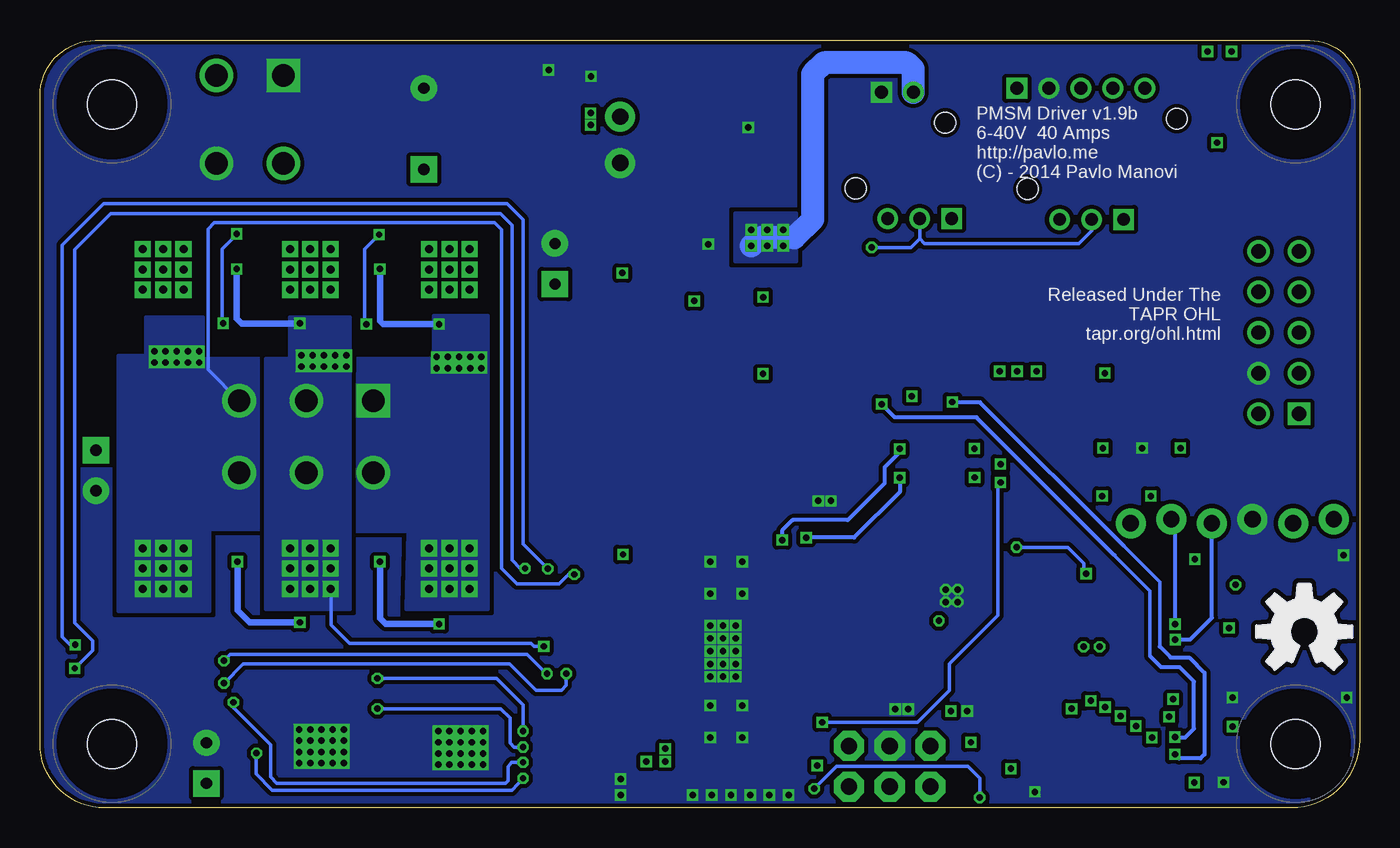
[diagram p9: board, bottom side, seen from below]

Size 82.5 x 48 mm. Coordinates in mm from the lower left corner, seen from the top.
Outline: 0,44.88 0,4.24 arc90 4.24,0 78.47,0 arc90 82.5,4.03 82.5,44.53 arc90 79.03,48 3.12,48 arc90 0,44.88
Copper layers (1*2*15*16): Top 0.035mm / dielectric 1.5mm / Route2 0.035mm / dielectric 0.15mm / Route15 0.035mm / dielectric 0.2mm / Bottom 0.035mm
Design rules "default *": minimum track width 6mil, minimum drill 12mil, track to track 6mil, track to pad 6mil, pad to pad 6mil, via to via 6mil, smd to smd 0mil, copper to edge 8mil, drill to drill 8mil, minimum pad ring 10mil, minimum via ring 6mil, stop-mask expansion 2mil, vias tented up to drill 100mil, thermal gap 10mil

### Footprints (pad centres in the part's own frame; a part is rotated, then mirrored left to right if it is on the bottom)
0805 = smd 0.8 x 1.2: 1 -0.9,0; 2 0.9,0
1210 = smd 1.2 x 2: 1 -1.6,0; 2 1.6,0
CPOL-RADIAL-10UF-25V = drill 0.7 pad 1.651 square: 1 1.27,0 | drill 0.7 pad 1.651: 2 -1.27,0
CPOL-RADIAL-1000UF-25V = drill 0.7 pad 1.651 square: 1 2.54,0 | drill 0.7 pad 1.651: 2 -2.54,0
CPOL-RADIAL-100UF-25V = drill 0.7 pad 1.651 square: 1 1.27,0 | drill 0.7 pad 1.651: 2 -1.27,0
STAND-OFF-TIGHT = hole 3.048: 0,0
HTSSOP-480-DCA = smd 1.4 x 0.3: 1 -3.55,5.75; 2 -3.55,5.25; 3 -3.55,4.75; 4 -3.55,4.25; 5 -3.55,3.75; 6 -3.55,3.25; 7 -3.55,2.75; 8 -3.55,2.25; 9 -3.55,1.75; 10 -3.55,1.25; 11 -3.55,0.75; 12 -3.55,0.25; 13 -3.55,-0.25; 14 -3.55,-0.75; 15 -3.55,-1.25; 16 -3.55,-1.75; 17 -3.55,-2.25; 18 -3.55,-2.75; 19 -3.55,-3.25; 20 -3.55,-3.75; 21 -3.55,-4.25; 22 -3.55,-4.75; 23 -3.55,-5.25; 24 -3.55,-5.75; 25 3.55,-5.75; 26 3.55,-5.25; 27 3.55,-4.75; 28 3.55,-4.25; 29 3.55,-3.75; 30 3.55,-3.25; 31 3.55,-2.75; 32 3.55,-2.25; 33 3.55,-1.75; 34 3.55,-1.25; 35 3.55,-0.75; 36 3.55,-0.25; 37 3.55,0.25; 38 3.55,0.75; 39 3.55,1.25; 40 3.55,1.75; 41 3.55,2.25; 42 3.55,2.75; 43 3.55,3.25; 44 3.55,3.75; 45 3.55,4.25; 46 3.55,4.75; 47 3.55,5.25; 48 3.55,5.75 | smd 3.48 x 4.42: 49 0,0
1X02_LOCK = drill 1.016 pad 1.88: 1 -0.178,0; 2 2.718,0
2X03 = drill 1.016 pad 1.88 octagon: 1 -2.54,-1.27; 2 -2.54,1.27; 3 0,-1.27; 4 0,1.27; 5 2.54,-1.27; 6 2.54,1.27
1X06_LOCK = drill 1.016 pad 1.88: 1 0,0.127; 2 2.54,-0.127; 3 5.08,0.127; 4 7.62,-0.127; 5 10.16,0.127; 6 12.7,-0.127
LED-0805 = smd 0.8 x 1.2: 1 -0.9,0; 2 0.9,0
SMT-REF = smd 3.505 x 5.08: 1 2.134,0; 2 -2.007,0
EXB-38V271JV = smd 0.5 x 1: P$1 0,0; P$2 0.8,0; P$3 1.6,0; P$4 2.4,0; P$5 2.4,1.4; P$6 1.6,1.4; P$7 0.8,1.4; P$8 0,1.4
SJ = smd 1.168 x 1.6: 1 -0.762,0; 2 0.762,0
TP06R = smd 0.6 x 0.6: TP 0,0
D8 = smd 1.981 x 0.559: 1 -2.464,1.905; 2 -2.464,0.635; 3 -2.464,-0.635; 4 -2.464,-1.905; 5 2.464,-1.905; 6 2.464,-0.635; 7 2.464,0.635; 8 2.464,1.905
PW16 = smd 1.676 x 0.356: 1 -2.819,2.286; 2 -2.819,1.626; 3 -2.819,0.965; 4 -2.819,0.33; 5 -2.819,-0.33; 6 -2.819,-0.965; 7 -2.819,-1.626; 8 -2.819,-2.286; 9 2.819,-2.286; 10 2.819,-1.626; 11 2.819,-0.965; 12 2.819,-0.33; 13 2.819,0.33; 14 2.819,0.965; 15 2.819,1.626; 16 2.819,2.286
QFP64-10X10MC = smd 1.473 x 0.279: 1 -5.613,3.759; 2 -5.613,3.251; 3 -5.613,2.743; 4 -5.613,2.261; 5 -5.613,1.753; 6 -5.613,1.245; 7 -5.613,0.762; 8 -5.613,0.254; 9 -5.613,-0.254; 10 -5.613,-0.762; 11 -5.613,-1.245; 12 -5.613,-1.753; 13 -5.613,-2.261; 14 -5.613,-2.743; 15 -5.613,-3.251; 16 -5.613,-3.759; 33 5.613,-3.759; 34 5.613,-3.251; 35 5.613,-2.743; 36 5.613,-2.261; 37 5.613,-1.753; 38 5.613,-1.245; 39 5.613,-0.762; 40 5.613,-0.254; 41 5.613,0.254; 42 5.613,0.762; 43 5.613,1.245; 44 5.613,1.753; 45 5.613,2.261; 46 5.613,2.743; 47 5.613,3.251; 48 5.613,3.759 | smd 0.279 x 1.473: 17 -3.759,-5.613; 18 -3.251,-5.613; 19 -2.743,-5.613; 20 -2.261,-5.613; 21 -1.753,-5.613; 22 -1.245,-5.613; 23 -0.762,-5.613; 24 -0.254,-5.613; 25 0.254,-5.613; 26 0.762,-5.613; 27 1.245,-5.613; 28 1.753,-5.613; 29 2.261,-5.613; 30 2.743,-5.613; 31 3.251,-5.613; 32 3.759,-5.613; 49 3.759,5.613; 50 3.251,5.613; 51 2.743,5.613; 52 2.261,5.613; 53 1.753,5.613; 54 1.245,5.613; 55 0.762,5.613; 56 0.254,5.613; 57 -0.254,5.613; 58 -0.762,5.613; 59 -1.245,5.613; 60 -1.753,5.613; 61 -2.261,5.613; 62 -2.743,5.613; 63 -3.251,5.613; 64 -3.759,5.613
RKG41 = smd 1.6 x 1.702: 1 0,0; 11 0,-10.109; 19 8.179,-10.109; 29 8.179,0 | smd 0.94 x 0.61: 2 -0.33,-1.448; 3 -0.33,-2.362; 4 -0.33,-3.251; 5 -0.33,-4.166; 6 -0.33,-5.055; 7 -0.33,-5.944; 8 -0.33,-6.858; 9 -0.33,-7.747; 10 -0.33,-8.661; 20 8.509,-8.661; 21 8.509,-7.747; 22 8.509,-6.858; 23 8.509,-5.944; 24 8.509,-5.055; 25 8.509,-4.166; 26 8.509,-3.251; 27 8.509,-2.362; 28 8.509,-1.448 | smd 0.61 x 0.94: 12 1.397,-10.49; 13 2.286,-10.49; 14 3.2,-10.49; 15 4.089,-10.49; 16 4.978,-10.49; 17 5.893,-10.49; 18 6.782,-10.49; 30 6.782,0.381; 31 5.893,0.381; 32 4.978,0.381; 33 4.089,0.381; 34 3.2,0.381; 35 2.286,0.381; 36 1.397,0.381 | smd 1.1 x 2.25: 37 3.88,-1.75 | smd 3.1 x 2.2: 38 2.8,-5.16; 39 2.8,-8.64 | smd 1.4 x 1.24: 40 6.43,-9.11 | smd 2.04 x 3.05: 41 6.75,-6.37
MUA08A = smd 1.372 x 0.457: 1 -2.184,0.965; 2 -2.184,0.33; 3 -2.184,-0.33; 4 -2.184,-0.965; 5 2.184,-0.965; 6 2.184,-0.33; 7 2.184,0.33; 8 2.184,0.965
DO-220AA = smd 2.67 x 2.54: ANODE 0,0 | smd 0.762 x 1.27: CATHODE 2.351,0
TO127P600X120-5N = smd 1.65 x 0.6: 1 -2.65,1.905; 2 -2.65,0.635; 3 -2.65,-0.635; 4 -2.65,-1.905 | smd 4.6 x 4.5: 5 1.15,0 | drill 0.5 square: P$1 0,1.27; P$2 1.27,1.27; P$3 2.54,1.27; P$4 2.54,0; P$5 1.27,0; P$6 0,0; P$7 0,-1.27; P$8 1.27,-1.27; P$9 2.54,-1.27
NETJUMPER = smd 0.254 x 0.254: P$1 -0.1,0; P$2 0.1,0
55932-0310 = drill 0.8 square: 1 -2,0 | drill 0.8: 2 0,0; 3 2,0 | hole 1.3: 4,1.9
0039288040 = drill 1.4 square: 1 -2.1,2.75 | drill 1.4: 2 2.1,2.75; 3 -2.1,-2.75; 4 2.1,-2.75
0039288060 = drill 1.4 square: 1 -4.2,2.25 | drill 1.4: 2 -4.2,-2.25; 3 0,2.25; 4 0,-2.25; 5 4.2,2.25; 6 4.2,-2.25
55932-0210 = drill 0.8 square: 1 -1,0 | drill 0.8: 2 1,0 | hole 1.3: 3,1.9
55932-0510 = drill 0.8 square: 1 -4,0 | drill 0.8: 2 -2,0; 3 0,0; 4 2,0; 5 4,0 | hole 1.3: 6,1.9
FOUR-WALL-2500-LP-STH = drill 0.9: 1 -5.08,-1.27; 3 -2.54,-1.27; 4 -2.54,1.27; 5 0,-1.27; 6 0,1.27; 7 2.54,-1.27; 8 2.54,1.27; 9 5.08,-1.27; 10 5.08,1.27 | drill 0.9 square: 2 -5.08,1.27

### Placement (x,y rotation side)
C3  43.4,2 270 top
C4  44.8,2 270 top
C5  50.73,44.55 90 top
C6  33.08,28.75 0 top
C7  1.02,14.85 90 top
C8  68.4,5.7 270 top
C9  46.95,14.2 0 top
C10  51,11.05 270 top
C11  51.72,7.1 0 top
C12  72.1,2.8 270 top
C13  59.9,5.6 270 top
C14  79,21.1 90 top
C15  12.8,21.6 90 top
C16  28.91,13.24 180 top
C17  28.94,11.62 180 top
C18  30.87,6.07 0 top
C19  36.16,2.55 180 top
C20  23.64,6.04 0 top
C21  9.43,1.61 180 top
C22  15.02,27.19 0 top
C23  28.01,24.83 90 top
C24  26.44,6.05 0 top
C25  14.51,15.12 0 top
C26  8.08,12.45 180 top
C27  58.5,42.47 270 top
C28  44.6,32.55 90 top
C29  14.4,21.6 90 top
C30  7.95,6 90 top
C32  43.4,23.2 270 top
C33  38.2,25.7 0 top
C34  38.2,27.15 0 top
C35  43.25,29.6 270 top
C36  38.2,31.95 0 top
C40  33.08,25.75 0 top
C41  50.73,39.75 270 top
C42  50.3,34.02 270 top
C43  45.08,36.6 270 top
C45  33.08,31.75 0 top
C47  44.73,46.45 90 top
E$1  [STAND-OFF-TIGHT]  4,44 0 top
E$2  [STAND-OFF-TIGHT]  4,4 0 top
E$3  [STAND-OFF-TIGHT]  78,4 0 top
E$4  [STAND-OFF-TIGHT]  78,44 0 top
IC1  39.8,9.8 0 top
J1  46.23,43.05 270 top
JP1  29.38,2.6 0 top
JP3  1.61,17.93 0 top
LED1  1.65,12.55 180 top
LED2  1.65,11.05 180 top
LED3  1.65,9.55 180 top
LED4  1.65,8.05 180 top
LED5  24.98,20.65 0 top
LED6  24.98,22.45 0 top
R1  32.11,19.25 180 top
R2  8.03,46.35 90 top
R3  9.47,46.35 90 top
R4  65,5.8 270 top
R5  2.62,14.85 270 top
R6  4.3,14.85 270 top
R7  8.88,42.55 270 top
R8  27.4,17.4 180 top
R9  78.5,30.7 270 top
R10  79,10.5 90 top
R11  24.3,18.4 180 top
R12  10.57,36.65 90 top
R14  27.88,22.45 180 top
R15  27.88,20.65 180 top
R16  70.2,30.05 180 top
R17  21.68,31.43 90 top
R18  7.75,14.85 90 top
R19  6,14.85 270 top
R20  46.1,32.55 90 top
R21  69.6,10.1 90 top
R22  56.2,5.8 270 top
R23  24.3,16.4 180 top
R24  34.48,46.85 180 top
R25  41.12,46.8 180 top
R26  47.12,47.15 0 top
R27  47.12,45.75 180 top
R28  61.2,30.05 180 top
R29  61.2,10.1 90 top
R30  11.2,21.6 270 top
R31  16,21.6 270 top
RN1  5.1,9.12 90 top
SJ8  23.48,31.36 90 top
TP1  29.53,19.47 0 top
TP2  29.52,18.37 0 top
TP3  29.52,17.4 0 top
TP4  29.5,16.45 0 top
U2  27.37,30.09 90 top
U3  14.99,30.6 0 top
U6  15.5,7.4 270 top
U7  34.33,44.35 0 top
U$1  39.5,23.25 180 top
U$2  79.83,25.82 90 top
U$3  70.2,33.7 270 top
U$4  74.8,32.4 90 top
U$5  65.6,32.4 90 top
U$6  61.25,33.7 270 top
U$7  74.8,13.7 90 top
U$8  65.6,13.7 90 top
U$9  61.25,15.4 270 top
U$10  76.5,9.4 180 top
U$11  68,3.4 180 top
U$12  68,8 0 top
U$13  56.9,32.4 90 top
U$14  27.5,36.85 0 top
U$15  56.9,13.7 90 top
U$16  69.38,43.05 0 top
U$17  65.85,23.2 0 top
U$18  28.9,44.75 180 top
U$19  16.75,36.8 0 top
U$20  17.43,45 180 top
U$21  5.05,29.73 90 top
U$22  39.5,29.6 180 top
U$23  54,1.8 90 top
U$24  59.2,7.4 0 top
U$25  70.15,15.4 270 top
U$26  79.47,15.4 270 top

### Tracks (layer width: path | path; a pad name or v marks a point on that pad's centre or on a via)
*SCS
  Top 0.203: IC1.4 34.85,14.05 TP1.TP | 29.52,19.38 TP1.TP | TP1.TP 20.15,19.47 16.15,15.42 16.15,14.25 15.75,13.85 U6.8
BST_B
  Top 0.203: IC1.39 49.35,11.05 50.2,11.9 50.95,11.9 C10.1
BST_C
  Top 0.203: IC1.34 48.15,8.55 49.6,7.1 C11.1
CAN_H
  Top 0.203: U$19.3 20.15,36.8 21.15,35.8 | 21.15,35.8 21.15,32.86 R17.2 | U$14.3 29.5,35.9 28.75,35.15 27.3,35.15 26.73,34.59 U2.7 26.73,34.47 26.1,35.1 21.85,35.1 21.15,35.8
CAN_L  (via drill 0.4)
  Top 0.203: SJ8.2 23.86,31.75 24.3,31.75 25.05,31 27.7,31 28,31.3 U2.6 28,34.01 28.55,34.55 30,34.55 v30.5,35.05
  Bottom 0.203: U$19.2 16.75,36.1 17.55,35.3 27.2,35.3 27.5,35.6 | 27.5,35.6 U$14.2 | v30.5,35.05 28.05,35.05 27.5,35.6
CANRX  (via drill 0.4)
  Top 0.254: U6.31 11.26,4.15 v11.54,4.43 | v29.88,25.25 29.75,25.25 29.28,25.72 U2.4
  Bottom 0.203: 13.1,9.5 13.1,13.58 15.32,15.8
  Bottom 0.254: v29.88,25.25 29.05,24.42 23.94,24.42 15.32,15.8 | 13.1,9.5 12.4,8.8 11.25,8.8 10.35,7.9 10.35,4.95 10.9,4.4 11.51,4.4 v11.54,4.43
CANTX  (via drill 0.4)
  Top 0.254: U6.32 11.24,3.64 v11.53,3.35 v11.54,3.35 | v25.46,25.38 U2.1
  Bottom 0.203: 12.5,10.1 12.5,14.14 14.76,16.4
  Bottom 0.254: v25.46,25.38 25.44,25.36 23.72,25.36 14.76,16.4 | 12.5,10.1 11.8,9.4 10.65,9.4 9.7,8.45 9.7,3.35 9.95,3.1 11.29,3.1 v11.54,3.35 11.39,3.2
CH_A_N
  Top 0.152: U$21.5 arc90 7.27,28.78 7.4,28.78 arc90 7.67,29.04 7.67,30.01 arc-90 7.93,30.28 8.81,30.28 arc-90 9.08,30.01 9.08,29.04 arc90 9.35,28.78 9.5,28.78 arc90 9.8,29.07 9.8,29.18 arc-91 10.92,30.27 U3.5
CH_A_P
  Top 0.152: U$21.6 arc90 5.03,28.47 9.5,28.47 arc90 10.1,29.07 10.1,29.18 arc-90 10.57,29.65 10.62,29.65 arc90 10.64,29.64 U3.6
CH_B_N
  Top 0.152: U3.4 10.72,30.93 arc-90 9.38,32.27 9.38,32.48 arc90 9.22,32.62 9.15,32.62 arc90 8.88,32.36 8.88,31.82 arc-90 8.61,31.55 8.61,31.55 arc-90 8.34,31.82 8.34,32.36 arc90 8.08,32.62 8.07,32.62 arc90 7.8,32.36 7.8,31.82 arc-90 7.54,31.55 7.53,31.55 arc-90 7.27,31.82 7.27,32.36 arc90 7,32.62 6.68,32.62 arc90 U$21.7
CH_B_P
  Top 0.152: U$21.8 arc-90 4.92,33.4 9.53,33.4 arc-90 9.9,33.02 9.9,32.1 arc90 10.43,31.58 arc90 10.44,31.57 U3.3
CH_I_N
  Top 0.152: U$21.9 arc90 7.07,34.05 7.38,34.05 arc90 7.64,34.32 7.64,34.71 arc-90 7.91,34.98 7.97,34.98 arc-90 8.23,34.71 8.23,34.32 arc90 8.5,34.05 8.55,34.05 arc90 8.82,34.32 8.82,34.71 arc-90 9.09,34.98 9.14,34.98 arc-90 9.41,34.71 9.41,34.32 arc90 9.68,34.05 9.85,34.05 arc-90 10.55,33.35 10.55,33 arc90 10.82,32.73 12.02,32.73 arc90 U3.1
CH_I_P
  Top 0.152: U$21.10 arc90 4.84,33.75 9.85,33.75 arc-90 10.25,33.35 10.25,33 arc97 11.18,32.17 12.12,32.17 arc90 U3.2
CRNT1  (via drill 0.4)
  Top 0.203: IC1.21 33.8,5.55 v33.6,5.35
  Route15 0.203: v22.45,20.35 21.2,21.6 11.75,21.6 11.2,22.15 R30.1
  Bottom 0.203: v33.6,5.35 27.65,5.35 25.65,7.35 25.65,9 22.6,12.05 22.6,20.1 v22.45,20.35
  other vias: 11.2,22.5
CRNT2  (via drill 0.4)
  Top 0.203: IC1.22 34.45,5.05 33.9,4.5 v33.9,2.65 | R31.1 v16.05,22.5
  Route2 0.203: v33.9,2.65 33.9,2.6 23.45,2.6 22.35,3.7 22.35,14.1 23.25,15 23.25,20.85 22.6,21.5 v22.45,21.5
  Route15 0.203: v22.45,21.5 21.45,22.5 v16.05,22.5
DC_CAL
  Top 0.203: IC1.8 32.95,12.05 30.3,14.7 19.43,14.7 18.75,14.03 U6.2
EN_GATE  (via drill 0.4)
  Top 0.203: IC1.12 27.12,10.05 26.3,10.88 v26.3,11.7 | v17.25,10.07 U6.5
  Route15 0.203: v17.25,10.07 24.68,10.07 v26.3,11.7
EXT1
  Top 0.203: U6.52 19.99,5.14 19.77,4.92 19.77,3.05 21.5,1.32 JP1.1
EXT2
  Top 0.203: U6.51 22.34,4.66 23.8,3.2 26.16,3.2 JP1.2
EXT3
  Top 0.203: U6.50 22.25,4.15 23.8,2.6 28.11,2.6 JP1.3
GH_A
  Top 0.203: IC1.43 46.65,13.05 47,13.4 47,15.1 47.3,15.4 49.3,15.4 52.3,18.4 52.3,36.8 53.3,37.8 70.1,37.8 71.3,36.6 77.5,36.6 78.5,35.6 R9.1
GH_B  (via drill 0.4)
  Top 0.203: IC1.38 49.75,10.55 50.2,11 51.9,11 52.1,11.2 52.1,13.6 53,14.5 53,36.5 53.7,37.2 68.9,37.2 v70.2,35.9 | v71.05,30.3 71.05,30.1 R16.1
  Bottom 0.203: v70.2,35.9 70.2,35.85 71.1,34.95 71.1,30.35 v71.05,30.3
GH_C  (via drill 0.4)
  Top 0.203: IC1.33 47.55,8.05 49.5,6.1 51.4,6.1 51.7,6.4 51.7,9.3 52.5,10.1 52.5,12.9 53.6,14 53.6,36.2 54,36.6 60.55,36.6 v61.3,35.85 | R28.1 v62.1,30.25
  Bottom 0.203: v61.3,35.85 62.2,34.95 62.2,30.35 v62.1,30.25
GL_A  (via drill 0.4)
  Top 0.203: IC1.41 47.95,12.05 50.75,14.85 v50.75,14.95 | v80.3,10.2 79.6,10.2 R10.1
  Bottom 0.203: v50.75,14.95 52.3,16.5 52.3,36.77 53.3,37.77 78.53,37.77 81.1,35.2 81.1,10.7 80.6,10.2 v80.3,10.2
GL_B  (via drill 0.4)
  Top 0.203: v71,9.2 R21.1 | IC1.36 49.65,9.55 v50.8,8.4
  Bottom 0.203: v50.8,8.4 50.85,8.4 52.05,9.6 70.6,9.6 v71,9.2
GL_C  (via drill 0.4)
  Top 0.203: IC1.31 46.55,7.05 48.8,4.8 v52.3,4.8 | v61.4,8.1 61.4,9 R29.1
  Bottom 0.203: v61.4,8.1 53.96,8.1 52.3,6.44 v52.3,4.8
GND  (via drill 0.4)
  Top 0.203: IC1.48 IC1.47 | U$23.P$2 54.43,1.9 R22.1 | U6.9 15.25,14.02 | 15.25,14.02 15.25,14.03 | U6.20 11.01,9.66 | U6.41 15.75,0.55 15.72,0.53 | U$10.P$2 76.1,9.4 75.8,9.7 | C13.2 57,4.7 v56.9,4.8 | 7.9,6.7 8,6.8 8.3,6.8 8.65,7.15 U6.25 | C8.2 67.2,4.8 67.1,4.7 | U$11.P$2 67.2,3.4 | 15.25,14.02 15.25,14.96 C25.2 | U3.12 17.62,30.27 17.6,30.25 16.75,30.25 16.55,30.05 16.55,28.5 16.75,28.3 U3.9 17.76,28.31 17.6,28.15
  Top 0.254: IC1.46 IC1.47 | IC1.24 38.25,4.05 v38.6,4.4
  Top 0.406: U$1.3 42.88,23.58 C32.1 | U$22.3 42.68,29.93 C35.1
  other vias: 38.23,42.55 40.73,35.25 39.8,9.8 40.6,9.8 40.6,9 39.8,9 39,9 39,9.8 39,10.6 39.8,10.6 40.6,10.6 39,11.4 39.8,11.4 40.6,11.4 40.6,8.2 39.8,8.2 39,8.2 40.6,13.4 38.6,13.4 38.6,15.4 40.6,15.4 40.6,6.4 38.6,6.4 40.6,4.4 28.23,6.17 29.02,6.17 25.12,13.65 25.88,13.65 25.12,12.88 25.88,12.88 24.52,6.05 56.2,4.8 55.5,4.8 54.8,4.8 57.6,4.8 54.8,4.1 55.5,4.1 56.2,4.1 56.9,4.1 57.6,4.1 57.6,3.4 56.9,3.4 56.2,3.4 55.5,3.4 54.8,3.4 54.8,2.7 55.5,2.7 56.2,2.7 56.9,2.7 57.6,2.7 63.5,4.9 64.2,4.9 64.9,4.9 65.6,4.9 66.3,4.9 63.5,4.2 64.2,4.2 64.9,4.2 65.6,4.2 66.3,4.2 66.3,3.5 65.6,3.5 64.9,3.5 64.2,3.5 63.5,3.5 63.5,2.8 64.2,2.8 64.9,2.8 65.6,2.8 66.3,2.8 35.7,0.8 36.9,0.8 38.1,0.8 39.3,0.8 40.5,0.8 41.7,0.8 46.2,0.8 46.2,1.8 1,15.8 0.8,6.9 20.3,1 13.6,22.5 33.05,19.2 33.85,19.2 7.95,6.9 8.5,1.6 48.05,45.75 50.7,46.15
  pour Top (isolate 0.254, rank 3, no thermals): 0,47.8 0,-0.1 83.1,-0.1 83.1,47.8
  pour Bottom (isolate 0.254, rank 5, no thermals): 0,48 83,48 83,0 0,0
  pour Route15 (isolate 0.254, rank 2, no thermals): 43,48 43,17 35,17 35,0 83,0 83,48
GND_REF
  Top 0.203: U$19.1 14.75,38.1 14.75,38.25 14.35,38.65 11.05,38.65 10.7,38.3 10.7,37.67 R12.2
  Top 0.254: U$14.1 20.85,36.85 19.45,38.25 14.9,38.25 14.75,38.1
HALL1  (via drill 0.4)
  Top 0.203: U6.48 19.26,3.78 18.84,4.2 15.3,4.2 14.95,4.55 v14.95,5.74
  Top 0.254: R7.1 9.45,43.45 9.9,43.9 10.5,43.9 11,44.4 12.1,44.4 12.7,43.8 16.9,43.8 17.4,44.3 17.4,44.98 U$20.3
  Route2 0.203: U$20.3 17.21,44.78 17.21,43.28 13.51,39.58 13.51,35.15 19.2,29.46 19.2,8.8 18.6,8.2 15.8,8.2 15,7.4 15,5.79 v14.95,5.74
HALL2  (via drill 0.4)
  Top 0.203: U6.47 18.75,3.35 18.5,3.6 14.8,3.6 14,4.4 14,5.1 v13.98,5.12
  Top 0.254: R3.1 10.45,45.45 12,47 14.9,47 15.4,46.5 15.4,45.02 U$20.4
  Route2 0.203: U$20.4 15.42,43.39 12.99,40.96 12.99,34.91 18.51,29.39 18.51,9.1 18.01,8.6 15.2,8.6 14,7.4 14,5.14 v13.98,5.12
HALL3  (via drill 0.4)
  Top 0.203: U6.46 18.24,2.82 18.07,2.99 14.38,2.99 v12.98,4.39
  Top 0.254: R2.1 8.03,44.88 8.4,44.5 10.3,44.5 12.1,46.3 13.1,46.3 13.4,46 13.4,45.02 U$20.5
  Route2 0.203: U$20.5 13.43,42.75 12.42,41.74 12.42,34.7 17.98,29.14 17.98,9.6 17.68,9.3 15,9.3 13,7.3 13,4.41 v12.98,4.39
I1  (via drill 0.4)
  Top 0.203: U6.27 11.01,6.16 v11.65,6.8 | v13.05,19.5 12.8,19.7 C15.1 R30.2
  Route2 0.203: v11.65,6.8 11.65,7.65 13.05,9.05 v13.05,19.5
I2  (via drill 0.4)
  Top 0.203: U6.28 11.85,5.65 v11.9,5.7 | v16.1,19.5 16,19.6 R31.2 C29.1
  Route2 0.203: v11.9,5.7 12.4,6.2 12.4,7.5 16.15,11.25 16.15,19.45 v16.1,19.5
LED1
  Top 0.203: U6.21 7.65,9.15 6.7,10.1 6.7,11.2 6.4,11.5 5.12,11.5 RN1.P$4
LED2
  Top 0.203: U6.22 7.55,8.64 6.3,9.9 6.3,10.4 5.9,10.8 5.17,10.8 RN1.P$3
LED3
  Top 0.203: U6.23 7.34,8.16 5.7,9.8 5.22,9.8 RN1.P$2
LED4
  Top 0.203: U6.24 5.95,7.65 5.1,8.5 RN1.P$1
MCLR  (via drill 0.4)
  Top 0.203: v16.25,10.07 U6.7
  Top 0.254: R5.1 2.55,15.75 2.55,16.5 1.61,17.44 JP3.1
  Route15 0.254: v16.25,10.07 16.25,11.75 15.12,12.88 4.62,12.88 1.85,15.65 1.85,17.9 JP3.1
MISO
  Top 0.203: IC1.6 34.25,13.05 30.3,16.8 29.7,17.4 TP3.TP R8.1
MOSI
  Top 0.203: IC1.5 34.55,13.55 29.73,18.37 TP2.TP 25.23,18.37 R11.1
N$1
  Top 0.203: R1.2 31.3,19.16 31.3,18.35 35.1,14.55 IC1.3
N$2
  Top 0.203: R6.2 R5.2 C7.1
N$3
  Top 0.203: R8.2 20.4,17.4 18.24,15.24 U6.3
N$4
  Top 0.203: IC1.44 45.4,13.55 C9.1
N$5
  Top 0.406: U$22.1 43.19,28.64 C35.2
N$6
  Top 0.203: C28.1 R20.1
N$7
  Top 0.203: R11.2 20,18.4 17.76,16.16 U6.4
N$8  (via drill 0.4)
  Top 0.203: R23.2 21.5,16.4 v21.45,16.3 | U6.6 16.75,14.29 v17.1,14.65
  Bottom 0.203: v21.45,16.3 18.25,16.3 17.25,15.3 17.25,14.8 v17.1,14.65
N$9
  Top 0.203: 76.75,29.8 U$4.4
  Top 0.406: 76.75,29.8 R9.2 79.83,28.48 U$2.CATHODE
N$10
  Top 0.406: U$7.4 76.7,11.4 R10.2 79,12.52 U$26.CATHODE
N$11
  Top 0.305: LED5.2 R15.2
N$12  (via drill 0.4)
  Top 0.203: IC1.1 36.1,15.7 v36.1,16.75 | R14.1 v28.75,22.45
  Bottom 0.254: v28.75,22.45 28.75,22.25 29.7,21.3 29.7,20.3 32,18 35.45,18 36.1,17.35 v36.1,16.75
N$13
  Top 0.61: U7.24 U7.23 | U7.23 U7.22 U7.21 | U7.23 41.5,38.41 U7.41 39.87,39.19 U7.38 34.1,39.19 U7.6 U7.7
N$14
  Top 0.406: U$1.1 43.38,22.29 C32.2
N$17
  Top 0.305: LED6.2 R14.2
N$18
  Top 0.203: IC1.9 32.05,11.55 30.4,13.2 30.05,13.2 C16.1
N$19
  Top 0.203: IC1.10 30.41,11.05 C17.1
N$20
  Top 0.203: IC1.11 28.65,10.55 28.4,10.8 28.4,11.58 C17.2
N$21
  Top 0.203: IC1.19 32.25,6.55 C18.2
N$22
  Top 0.203: IC1.23 34.85,4.55 34.65,4.35 34.65,3.3 35.26,2.69 C19.2
N$24  (via drill 0.4)
  Top 0.203: IC1.2 35.3,15.05 34.6,15.75 v34.6,16.9 | R15.1 v28.75,20.65
  Bottom 0.254: v28.75,20.65 28.75,19.75 31.6,16.9 v34.6,16.9
N$25
  Top 0.203: U6.15 12.25,14.03 11.97,14.3 10.07,14.3 8.62,15.75 R18.2
  Top 0.254: R19.1 R18.2
N$31
  Top 0.203: U6.56 22.43,7.15 22.75,6.83 22.75,5.92 C20.1
N$32
  Top 0.406: 67.56,29.7 U$5.4 69,29.75 R16.2 69.3,30.95 69.7,31.35 U$3.CATHODE
N$33
  Top 0.203: R21.2 69.1,11 | 67.56,11 U$8.4
  Top 0.406: U$25.CATHODE 70.15,12.05 69.1,11 67.56,11
N$36
  Top 0.406: U$13.4 58.85,29.8 60.05,29.8 R28.2 60.3,31.05 60.6,31.35 U$6.CATHODE
N$37
  Top 0.254: U7.36 35.72,46.5 R24.1
N$38
  Top 0.254: U7.31 40.22,46.79 R25.2
N$39
  Top 0.406: U$15.4 58.85,11 R29.2 61.25,11.05 U$9.CATHODE
N$41
  Top 0.254: U7.27 43.91,41.99 46.23,44.3 R27.2 R26.1
  Top 0.406: J1.1 R27.2
N$43
  Top 0.254: U7.28 43.58,42.9 44.73,44.05 C47.1
N$44
  Top 0.203: LED1.1 3.25,12.55 3.7,12.1 RN1.P$5
N$45
  Top 0.203: RN1.P$6 2.88,10.72 LED2.1
N$46
  Top 0.203: RN1.P$7 2.92,9.93 LED3.1
N$47
  Top 0.203: 4.1,9.03 RN1.P$8 3.7,8.4 3.35,8.05 LED4.1
N$64
  Top 0.203: R17.1 23.42,30.54 SJ8.1
OHL
  Bottom 0.2: 0.47,11.39 1.44,11.49 arc-19 1.7,12.12 1.09,12.87 1.6,13.39 2.36,12.77 arc-19 2.99,13.04 3.08,14 3.82,14 3.91,13.04 arc-19 4.54,12.77 5.3,13.39 5.81,12.87 5.2,12.12 arc-19 5.46,11.49 6.43,11.39 6.43,10.66 5.46,10.56 arc-19 5.2,9.93 5.81,9.18 5.3,8.66 4.54,9.28 arc-9 4.24,9.12 3.81,10.16 arc248 2.51,11.03 arc68 3.09,10.16 2.66,9.12 arc-9 2.36,9.28 1.6,8.66 1.09,9.18 1.7,9.93 arc-19 1.44,10.56 0.47,10.66
  Bottom 0.203: 0.47,10.66 0.47,11.07 | 0.47,11.39 0.47,11
PGC  (via drill 0.4)
  Top 0.254: U6.17 10.65,11.16 10.98,11.49 v11.53,11.49
  Bottom 0.254: v11.53,11.49 11.53,17.81 JP3.5
PGD  (via drill 0.4)
  Top 0.254: U6.18 11.39,10.65 v11.52,10.52
  Bottom 0.254: JP3.4 9.23,11.89 10.6,10.52 v11.52,10.52
PVDD  (via drill 0.4)
  Top 0.203: R20.2 | R18.1 | U$13.5 U$13.P$5 | U$5.5 U$5.P$5 | U$4.P$5 U$4.5
  Top 0.254: C5.1 49.58,42.95 48.98,43.55 48.98,47.05 48.83,47.2 48.08,47.2 R26.2
  Top 0.406: U7.26 42.83,41.05 43.83,41.05 44.33,40.55 44.33,37.75 C43.1 47.77,38.2 48.62,39.05 48.62,40.85 49.23,41.45 50.62,41.45 C41.1
  Top 0.61: 50.67,41.3 C41.1 C5.1
  Top 0.813: C5.1 50.48,42.7 v48.08,42.7 48.08,43.4 50.12,43.4 50.67,42.85 48.62,42.85 48.12,43.35 48.08,43.35
  Route2 0.203: R18.1 7.6,13.95 6.45,12.8 6.45,1.15 7.25,0.35 23.35,0.35 v23.75,0.65 | v34.1,1.2 34.5,1.2 35.15,1.85
  Bottom 0.203: v23.75,0.65 23.75,1.85 24.5,2.6 32.7,2.6 v34.1,1.2
  other vias: 48.08,43.45 46.1,33.45 43.4,2.9 43.4,3.7 44.6,2.9 7.75,13.95
  pour Top (rank 2, no thermals): 44.61,3.52 44.03,3.52 44.03,4.09 42.86,4.1 42.85,4.11 42.85,2.44 42.95,2.34 44.55,2.33 44.6,2.33
  pour Route2 (isolate 0.254, rank 2, no thermals): 43,48 43,17 35,17 35,0 83,0 83,48
PWM1H
  Top 0.203: IC1.13 26.82,9.55 23.35,13.03 19.27,13.03 U6.1
PWM1L
  Top 0.203: U6.64 24.42,11.16 26.55,9.03 36.23,9.03 IC1.14
PWM2H
  Top 0.203: IC1.15 26.2,8.55 24.1,10.65 U6.63
PWM2L
  Top 0.203: IC1.16 25.88,8.05 23.8,10.12 21.13,10.12 U6.62
PWM3H
  Top 0.203: IC1.17 25.57,7.55 23.48,9.65 21.12,9.65 U6.61
PWM3L
  Top 0.203: IC1.18 25.27,7.05 23.18,9.15 U6.60
QEI_A  (via drill 0.4)
  Top 0.203: U3.15 20.45,32.23 20.71,31.97 20.71,29.68 21.23,29.16 21.24,29.16 22.5,27.9 v22.5,27.3 | v18,6.2 18.4,6.6 21.07,6.6 U6.55
  Route2 0.203: v22.5,27.3 22.5,27 21.6,26.1 21.6,17.4 22.2,16.8 22.2,15.9 21.5,15.2 21.5,8 20,6.5 18.3,6.5 v18,6.2
QEI_B  (via drill 0.4)
  Top 0.203: U3.14 19.98,31.57 20.12,31.43 20.12,29.38 21.4,28.1 v21.4,27.3 | 21.06,6.1 U6.54 21.07,6.2 19.7,6.2 18.9,5.4 17,5.4 16.8,5.6 v16.8,6.7
  Route2 0.203: v21.4,27.3 21.4,27 20.8,26.4 20.8,8.4 19.4,7 17.1,7 v16.8,6.7
QEI_I  (via drill 0.4)
  Top 0.203: U3.11 19.09,29.64 20.55,28.17 20.55,27.65 v20.2,27.3 | v15.9,6.3 15.9,5.1 16.1,4.9 19,4.9 19.7,5.6 21.07,5.6 U6.53
  Route2 0.203: v20.2,27.3 20.2,9 18.8,7.6 16.3,7.6 15.9,7.2 v15.9,6.3
SCLK
  Top 0.203: IC1.7 33.75,12.55 30.3,15.9 29.75,16.45 TP4.TP 29.5,16.4 29.2,16.1 25.5,16.1 R23.1
SH_A  (via drill 0.4)
  Top 0.203: IC1.42 47.55,12.55 48,13 48,14.05 C9.2 48.7,14.2 v49.1,14.6
  Top 0.406: U$2.ANODE 77.17,25.82 77,26
  Bottom 0.203: v49.1,14.6 49.45,14.6 50.05,14 52.67,14 53.65,14.97 53.65,36.17 54.08,36.6 71.6,36.6 72,36.2 72,27.4 U$17.5
  other vias: 72.55,28.55 73.25,28.55 73.95,28.55 74.65,28.55 75.35,28.55 72.55,27.85 73.25,27.85 75.35,27.85 74.65,27.85 73.95,27.85
  pour Top (isolate 0.254, rank 2, no thermals): 75.9,30.7 72.3,30.7 72.3,28.1 68.8,28.1 68.8,17.4 71.9,17.4 71.9,12.3 77.6,12.3 77.6,28.3 75.9,28.3
  pour Bottom (isolate 0.254, rank 2, no thermals): 75.9,30.7 72.3,30.7 72.3,28.1 68.8,28.1 68.8,17.4 71.9,17.4 71.9,12.3 77.6,12.3 77.6,28.3 75.9,28.3
SH_B  (via drill 0.4)
  Top 0.203: IC1.37 50.9,10.05 C10.2 v51,10.1
  Bottom 0.203: 64.4,13.63 U$8.P$1 64.3,13.67 64.3,11.45 63.15,10.3 51.8,10.3 51.6,10.1 v51,10.1
  Bottom 0.406: U$3.ANODE 70.2,30.6 69.9,30.3 v66.25,30.3
  other vias: 70.2,33.7 63.35,28.3 64.05,28.3 64.75,28.3 65.45,28.3 66.15,28.3 63.35,27.6 64.05,27.6 64.75,27.6 65.45,27.6 66.15,27.6
  pour Top (isolate 0.254, no thermals): 63.1,30.7 66.9,30.7 66.9,28.1 68.4,28.1 68.4,12.4 63.1,12.4
  pour Bottom (isolate 0.254, no thermals): 63.1,30.7 66.9,30.7 66.9,28.1 68.4,28.1 68.4,12.4 63.1,12.4
SH_C  (via drill 0.4)
  Top 0.203: IC1.32 47.25,7.55 49.2,5.6 52.5,5.6 52.62,5.72 C11.2 53,7.48 53,12.3 54.2,13.5 55,13.5 55,13.4 55.35,13.05 | 55,12.7 55.35,13.05 | 55.35,13.05 55.63,13.33 U$15.P$1
  Bottom 0.406: U$6.ANODE 61.25,30.45 61.05,30.25 v57.55,30.25
  other vias: 61.25,33.7 54.9,28.2 55.6,28.2 56.3,28.2 57,28.2 57.7,28.2 54.9,27.5 55.6,27.5 56.3,27.5 57,27.5 57.7,27.5
  pour Top (isolate 0.254, rank 2, no thermals): 57.9,30.8 54.5,30.8 54.5,12.4 59.6,12.4 59.5,17.3 62.7,17.3 62.7,28.1 57.9,28.1
  pour Bottom (isolate 0.254, rank 2, no thermals): 57.9,30.8 54.5,30.8 54.5,12.4 59.6,12.4 59.5,17.3 62.7,17.3 62.7,28.1 57.9,28.1
SL_A  (via drill 0.4)
  Top 0.203: IC1.40 48.75,11.55 v52.17,14.97 | U$10.P$1 77.1,9.4 77.8,8.7 80.3,8.7 v80.33,8.72
  Bottom 0.203: v52.17,14.97 52.48,14.97 53,15.5 53,36.45 53.7,37.15 78.08,37.15 80.33,34.9 80.33,11.57 79.2,10.45 79.2,9.85 v80.33,8.72
SL_B  (via drill 0.4)
  Top 0.203: v71,7.8 68.4,7.8 U$12.P$2 | IC1.35 48.95,9.05 v49.6,8.4
  Bottom 0.203: v71,7.8 69.8,9 53.15,9 51.5,7.35 49.9,7.35 49.6,7.65 v49.6,8.4
SL_C  (via drill 0.4)
  Top 0.203: IC1.30 46.15,6.55 48.9,3.8 v52.3,3.8 | v61.4,6.2 61.4,7 61,7.4 U$24.P$2
  Bottom 0.203: v61.4,6.2 53.69,6.2 53.12,5.63 53.12,4.06 52.85,3.79 v52.31,3.79 v52.3,3.8
SN1  (via drill 0.4)
  Top 0.203: R4.2 66.21,6.6 C8.1 v70.4,6.6 | U$12.P$1 66.3,8 | IC1.29 45.65,6.05 49,2.7 52.1,2.7 v52.3,2.85
  Bottom 0.203: v52.3,2.85 53.02,2.85 53.24,2.58 53.24,1.7 53.39,1.55 67.7,1.55 68.08,1.93 68.08,3.94 70.4,6.26 v70.4,6.6
  Bottom 0.406: U$25.ANODE 70.15,12.35 69.4,11.6 v66.25,11.6
  other vias: 70.15,15.4
  pour Top (isolate 0.254, rank 2, no thermals): 62.5,12 66.7,12 66.7,9.6 67.6,9.6 67.6,6.1 62.5,6.1
SN2  (via drill 0.4)
  Top 0.203: U$24.P$1 58.2,7.4 | C13.1 57.51,6.5 R22.2 54.59,6.2 53.8,6.2 53.15,5.6 53.15,1.4 52.7,1 49.1,1 45.05,5.05 IC1.27
  Bottom 0.406: U$9.ANODE 61.25,11.85 60.9,11.5 v57.55,11.5
  other vias: 61.25,15.4
  pour Top (isolate 0.254, rank 2, no thermals): 58.2,11.85 53.6,11.85 53.6,6 58.8,6 58.8,9.8 58.2,9.8
SP1  (via drill 0.4)
  Top 0.203: IC1.28 45.35,5.55 49.2,1.7 52.1,1.7 v52.3,1.85 | v68.96,3.42 U$11.P$1
  Bottom 0.203: v52.3,1.85 v52.3,1.84 52.98,1.11 67.99,1.11 68.97,2.14 v68.97,3.41 v68.96,3.42
SP2
  Top 0.203: IC1.26 44.85,4.55 49,0.4 53.8,0.4 54,0.6 U$23.P$1
VCC3V3  (via drill 0.4)
  Top 0.203: U6.57 22.87,7.65 23.68,6.85 23.68,5.22 23.85,5.05 25,5.05 25.23,5.28 25.23,5.74 C24.1 | 25.6,5.89 C24.1 | JP3.2 4.15,15.9 R6.1 | U2.3 C23.2 | R2.2 R3.2 9.47,47.27 v9.5,47.3 | R7.2 8.88,41.62 v8.9,41.6 | U6.38 14.26,0.66 14.1,0.5 11.1,0.5 10.5,1.1 10.5,1.41 v10.33,1.58 C21.1 | C24.1 v25.55,6.05 | 13.83,14.83 13.83,14.89 C25.1 | U6.10 14.74,13.86 14.3,14.3 14.3,14.42 C25.1 | U6.26 9.88,6.65 9.1,6.65 8.8,6.35 8.8,6.15 7.95,5.3 C30.1 v7.93,5.08 | U6.19 8.86,10.14 8.15,10.85 v8.15,11.25 | 8.45,11.92 C26.1 8.98,12.78 | C25.1 10.73,15.12 v10.3,15.55
  Top 0.254: U3.13 16.33,30.93 16.2,30.8 | 16.2,30.8 16,30.6 16,27.27 C22.2 | U3.16 16.49,32.89 16,32.4 16,31 16.2,30.8 | v24.08,22.47 LED6.1 | v27.99,25.74 v28,25.74 C23.2 | JP1.6 31.91,4.37 32.85,5.3 32.85,5.8 33.1,6.05 IC1.20 | IC1.45 44.9,14.05 45.1,14.25 45.1,15.4 45.55,15.85 v46.05,15.85 | v8.15,11.25 8.15,11.62 C26.1
  Top 0.305: LED6.1 v24.07,20.65
  Top 0.406: 37.32,31.93 C36.1 v37.29,31.94 | U$22.6 U$22.5
  Top 0.61: U$22.5 37.32,31.93
  Route2 0.203: v10.3,15.55 10.3,15.65 10.2,15.75
  Route2 0.254: v46.05,15.85 44.15,15.85 41.8,18.2
  Route15 0.813: v24.3,4.1 22.65,2.45 v21.8,2.45
  other vias: 8,47.3 15.92,27.19
  pour Route2 (isolate 0.254, rank 5, no thermals): 0,48 42,48 42,18 34,18 34,0 0,0
VCC5V0  (via drill 0.4)
  Top 0.406: U$22.8 37.32,27.17 C34.1 C33.1 37.32,25.68 U$1.5 U$1.6 | U$22.4 41.68,31.62 v41.6,31.7
  other vias: 37.3,27.15
  pour Route15 (isolate 0.254, rank 6, no thermals): 0,48 42,48 42,18 34,18 34,0 0,0
VCC5V5  (via drill 0.4)
  Top 0.254: U7.10 33.14,35.69 32.83,36 32.83,46.1 R24.2 | v37.02,36.15 37.02,35.81 U7.39
  Top 0.406: U7.10 33.99,34.57 U7.11 34.71,33.86 | U7.15 U7.14 | U7.12 35.72,34.85 v36.02,35.15 | 34.67,26.5 34.65,26.48 34.65,23.6 35.97,22.29 U$1.8 38.53,22.29 40.47,24.21 U$1.4
  Top 0.61: C40.2 34.67,26.5 C6.2 C45.2 34.67,33.73 34.8,33.86 | 36.88,33.59 U7.13
  Top 0.813: U7.14 37.5,33.86
  Top 1.016: 37,35.15 37.52,34.62 U7.14 U7.13 U7.12 34.8,33.86 34.71,33.86
  Bottom 1.422: U$18.2 27.9,46.2 28.3,46.6 33.5,46.6 34.2,45.9 34.2,36.8 35.35,35.65 37.52,35.65 v38.02,35.15
  other vias: 36.02,36.15 37.02,35.15 38.02,36.15
  pour Bottom: 35.2,37.2 35.2,34.15 39.05,34.15 39.05,37.2

### Text on the board
Top: v1.9b | PMSMx
tPlace: v1.9b | PMSMx
tNames: CAN_L | CAN_H | NO SENSITIVE COMPONENTS ABOVE | V_IN | GND | GND | OCTW | FAULT | CS | ICSP | MOSI | MISO | SCLK
bNames: PMSM Driver v1.9b / 6-40V 40 Amps / http://pavlo.me / (C) - 2014 Pavlo Manovi | Released Under The / TAPR OHL / tapr.org/ohl.html